# EAGLE schematic main_mux (EAGLE 7.6.0), part 1 of 3
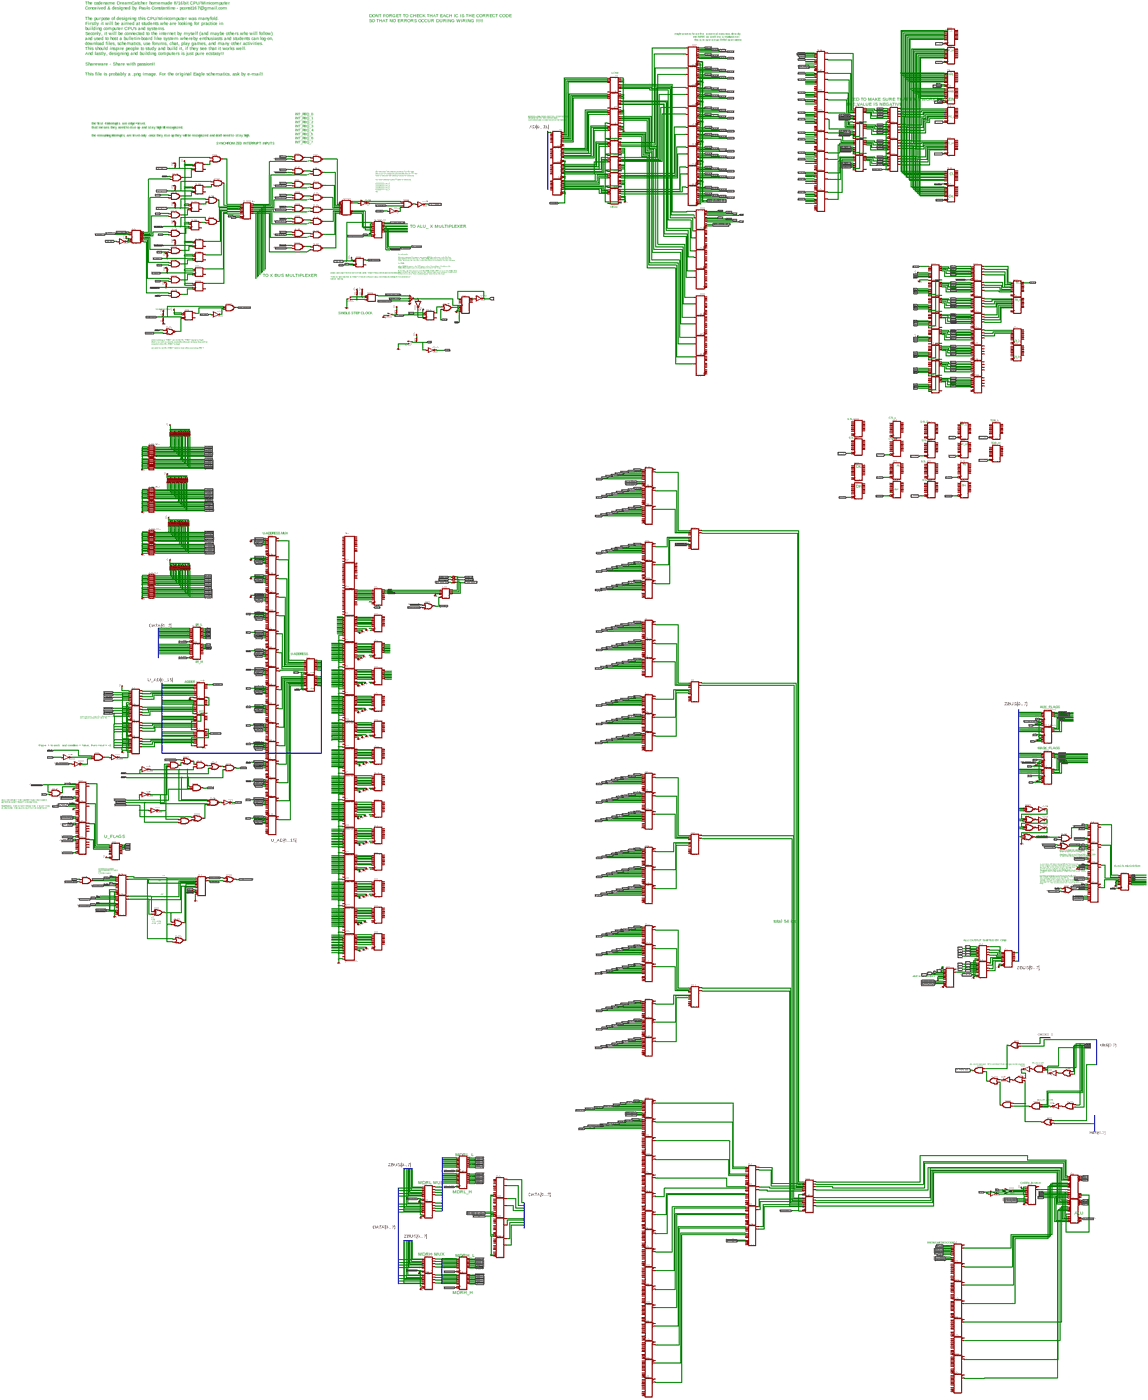
[diagram p0: schematic, sheet 1, overview]
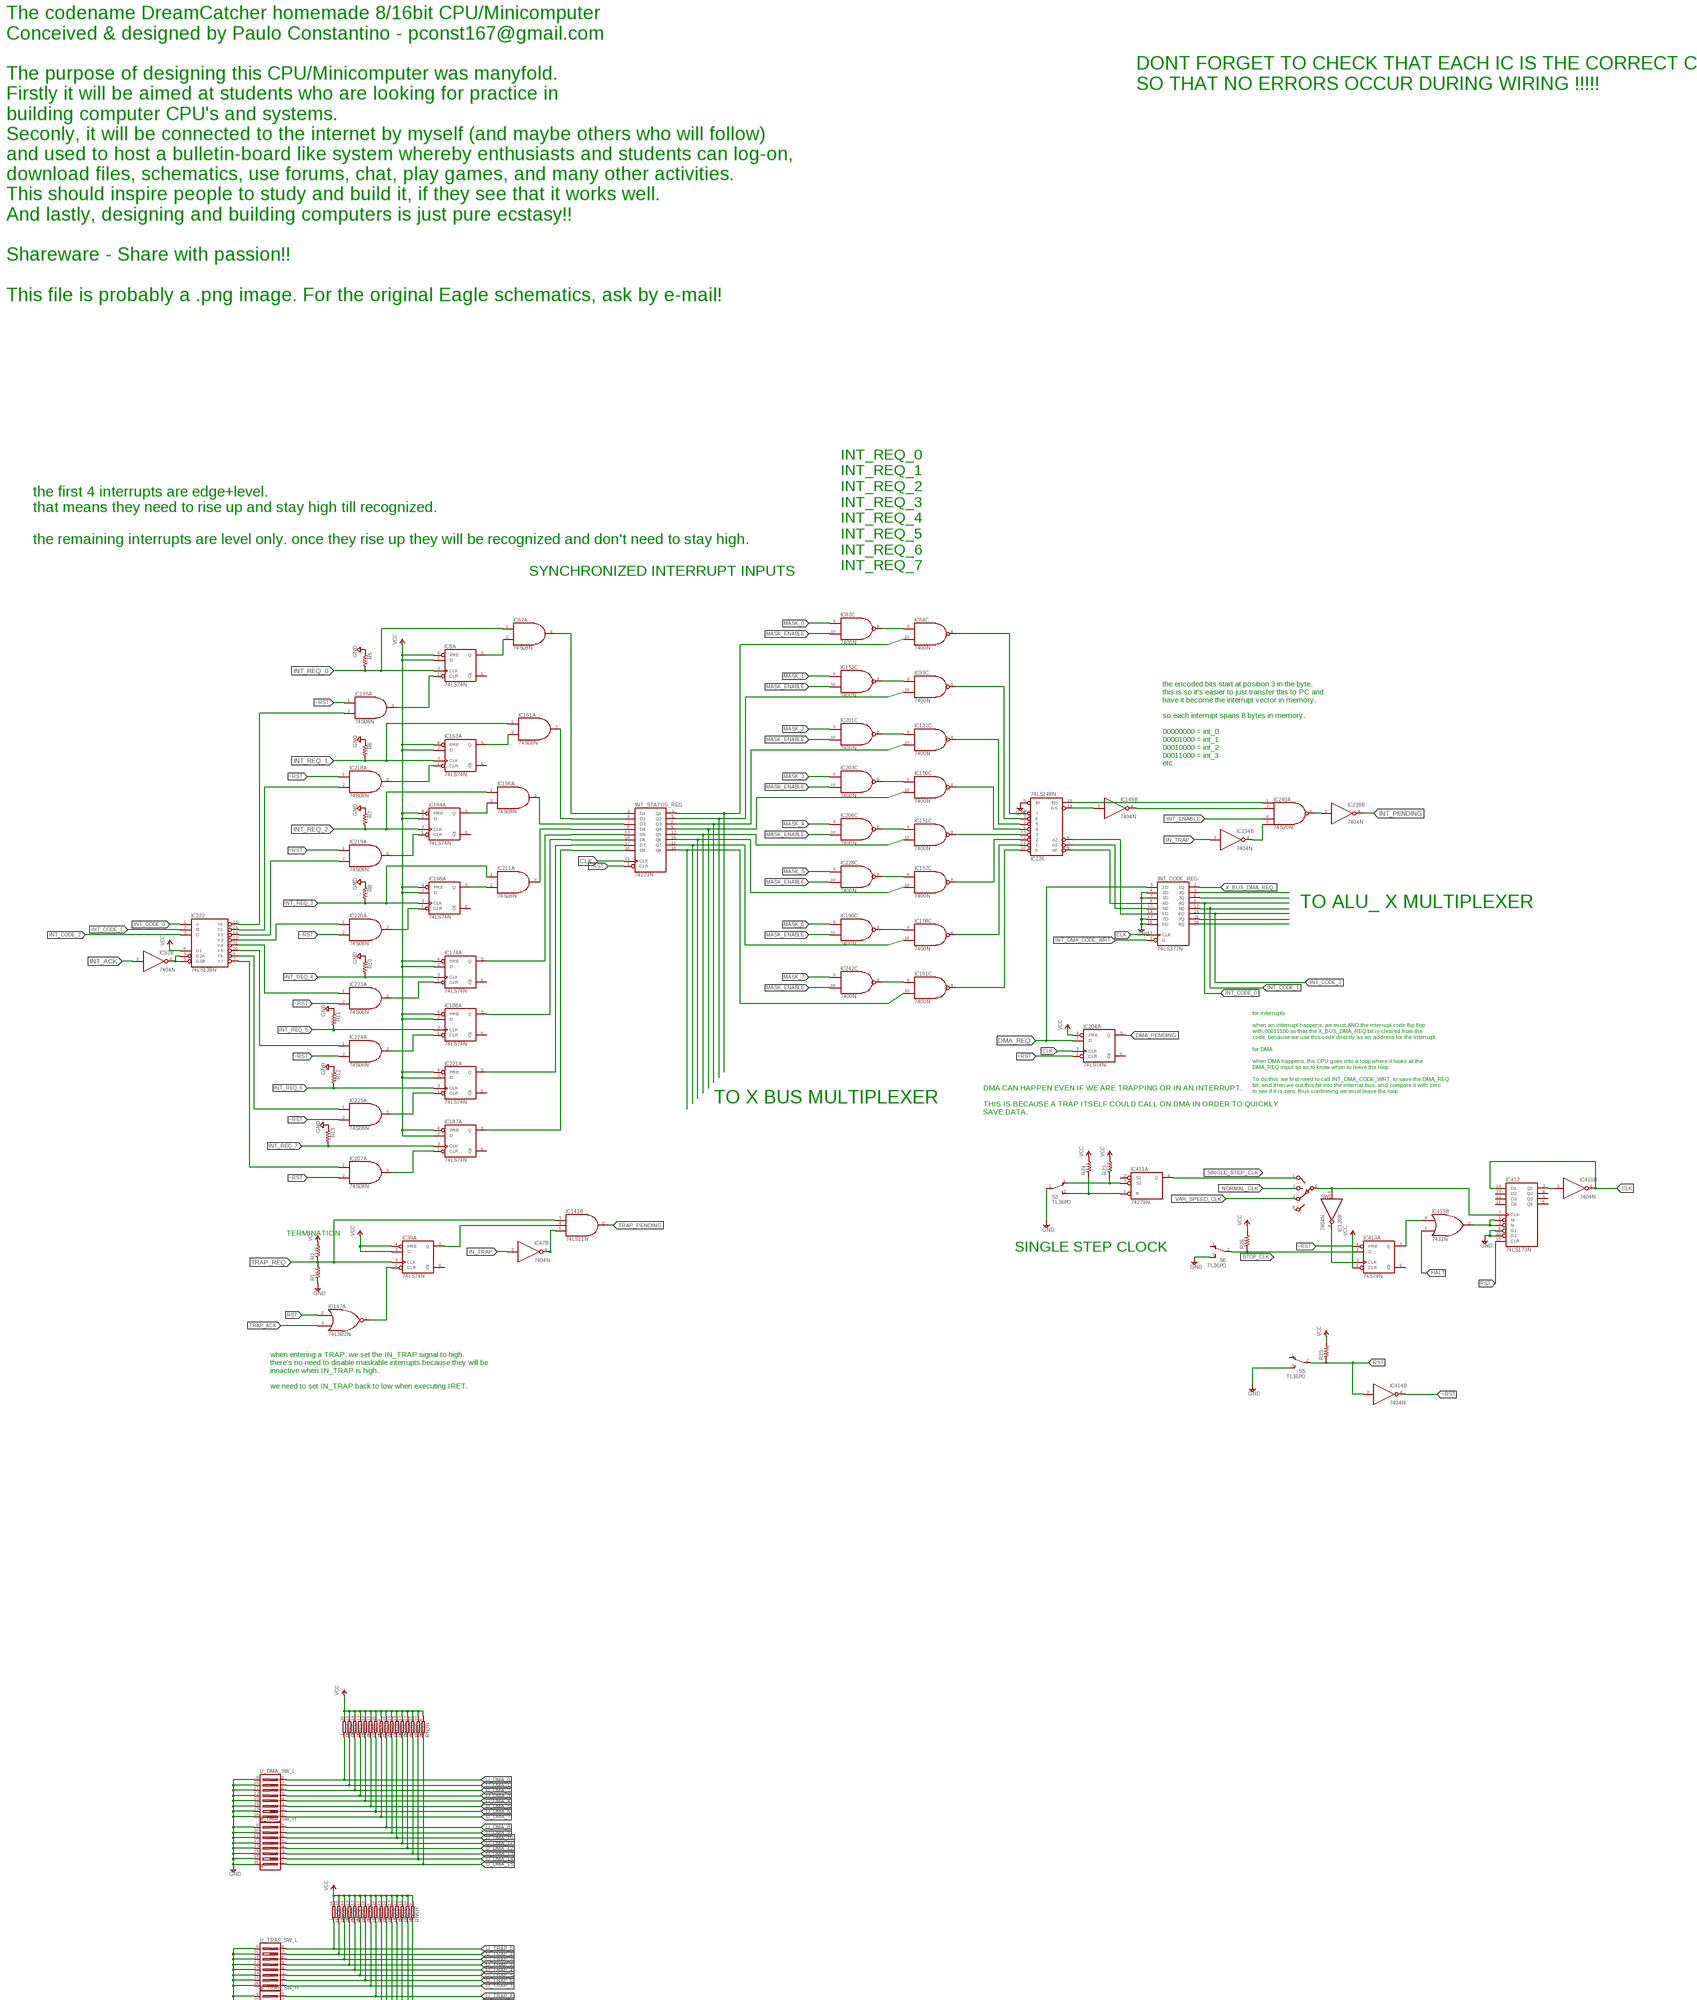
[diagram p1: schematic, sheet 1, part 1 of 6]
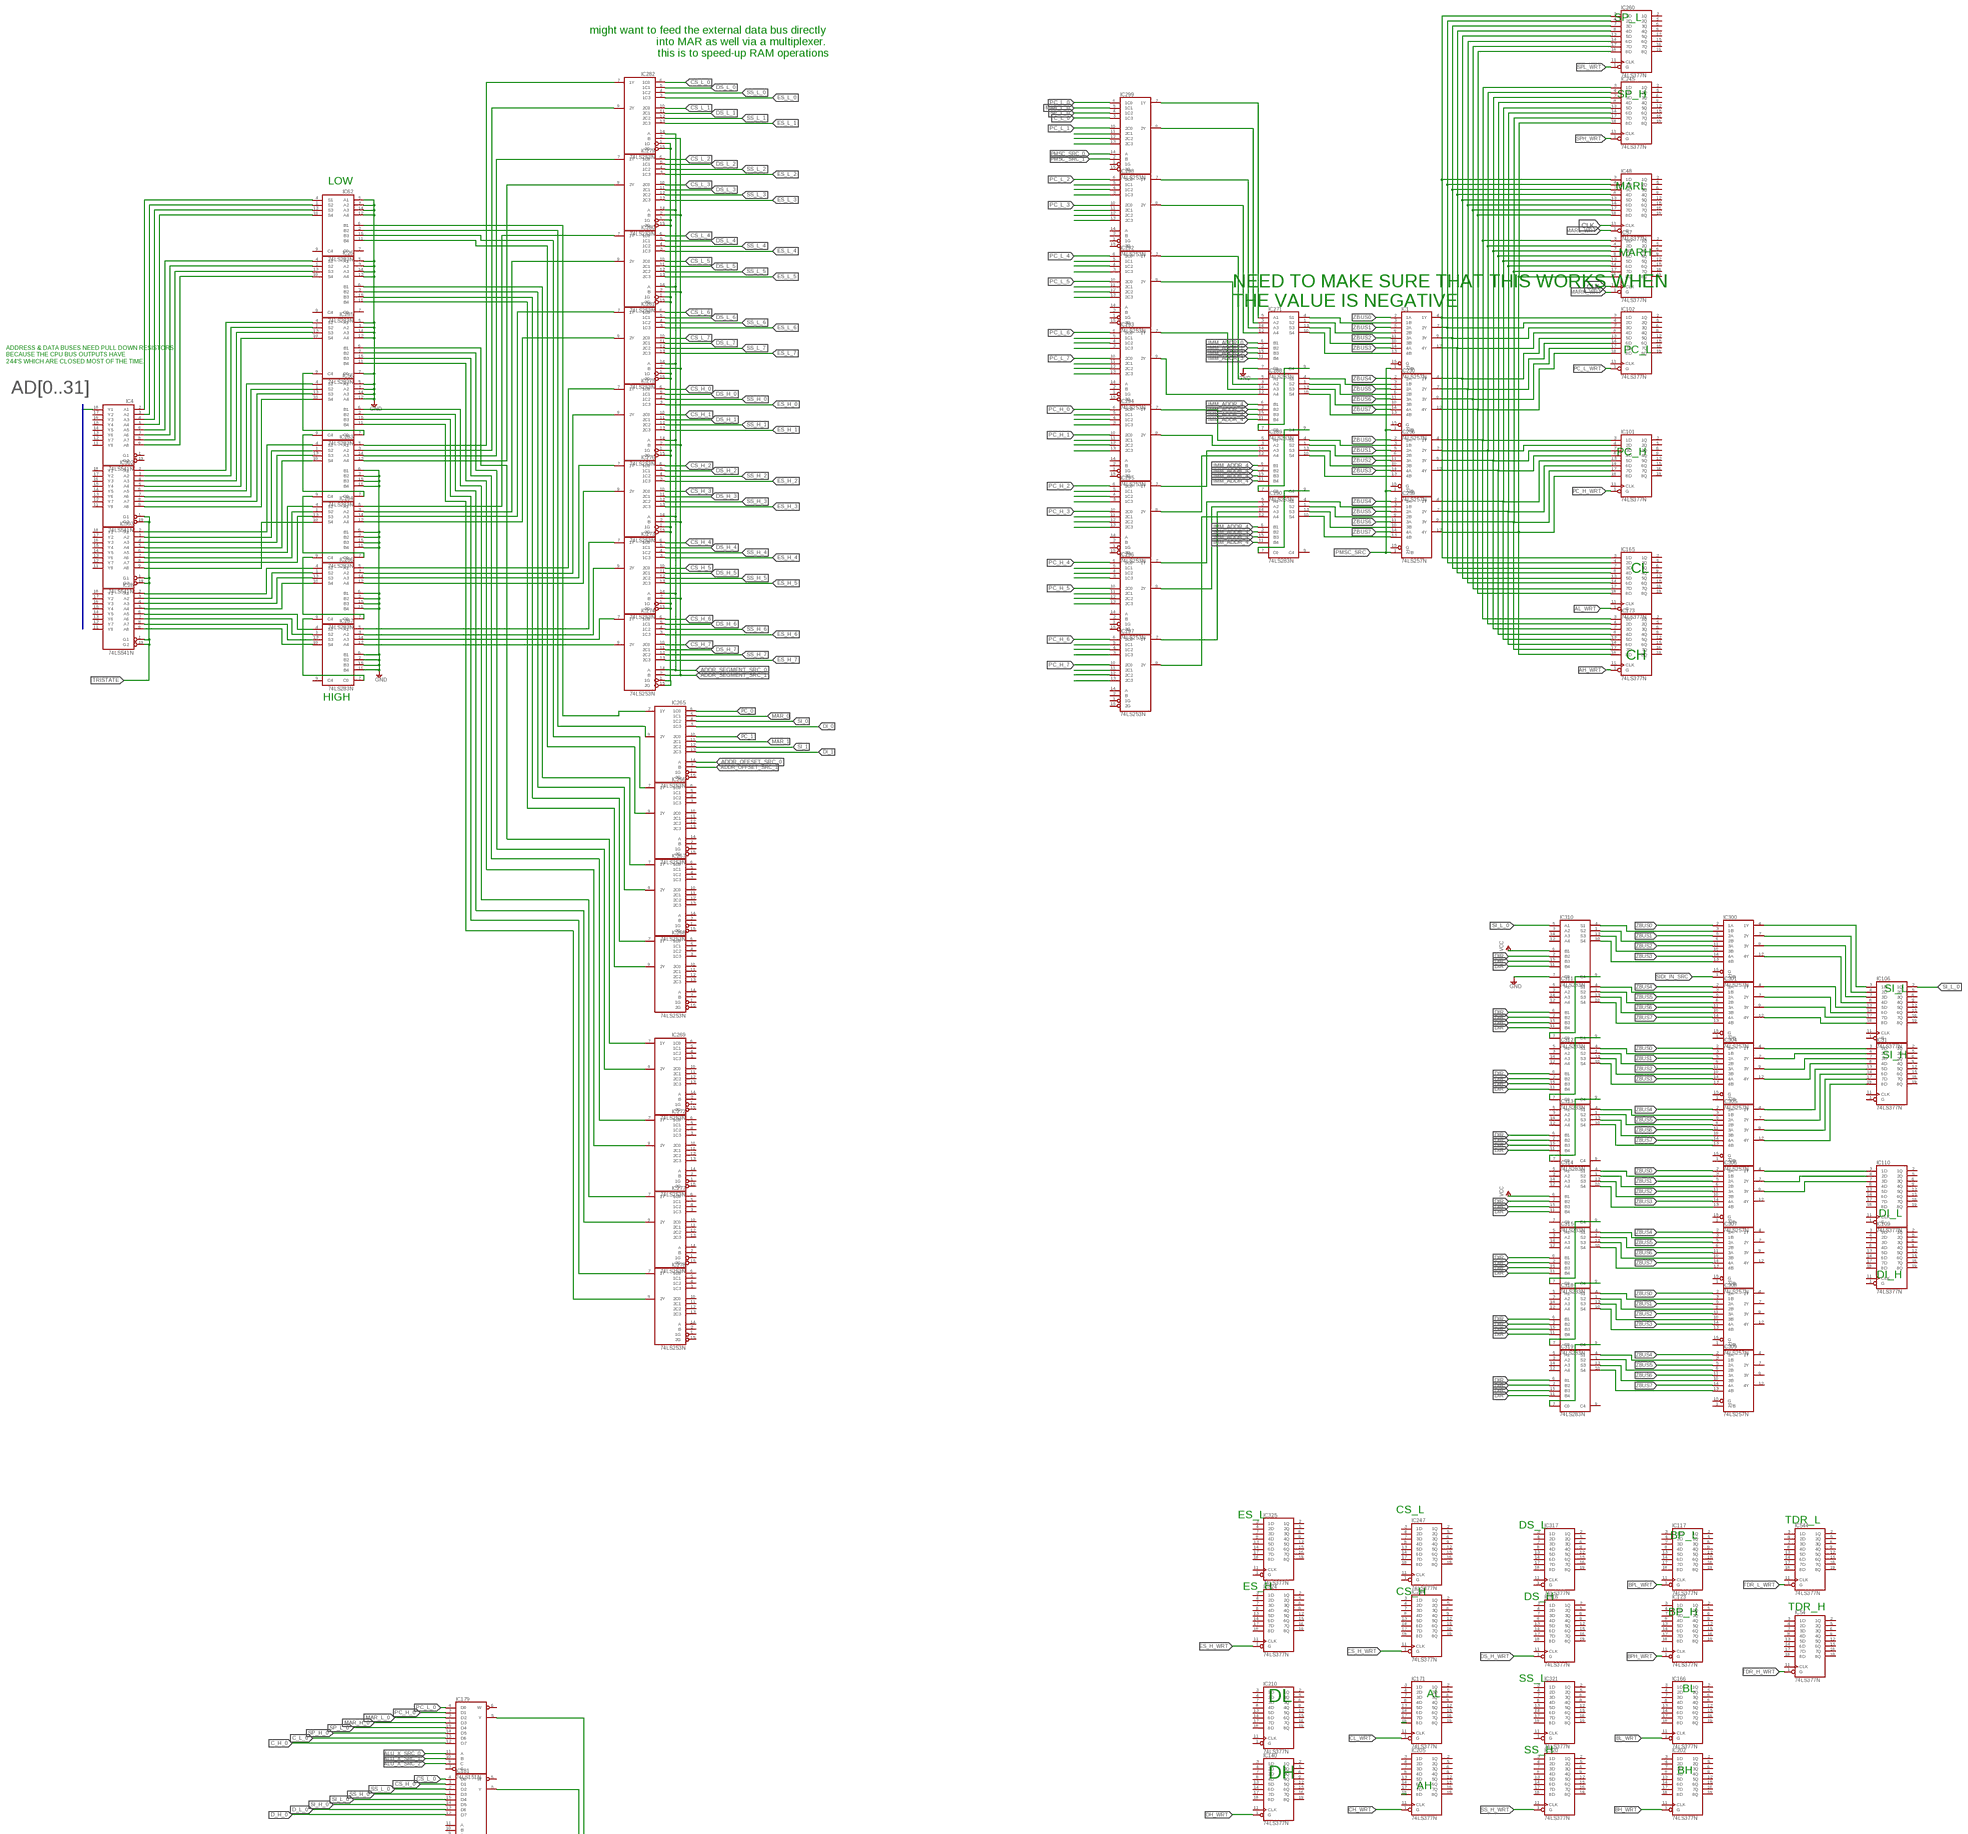
[diagram p2: schematic, sheet 1, part 2 of 6]
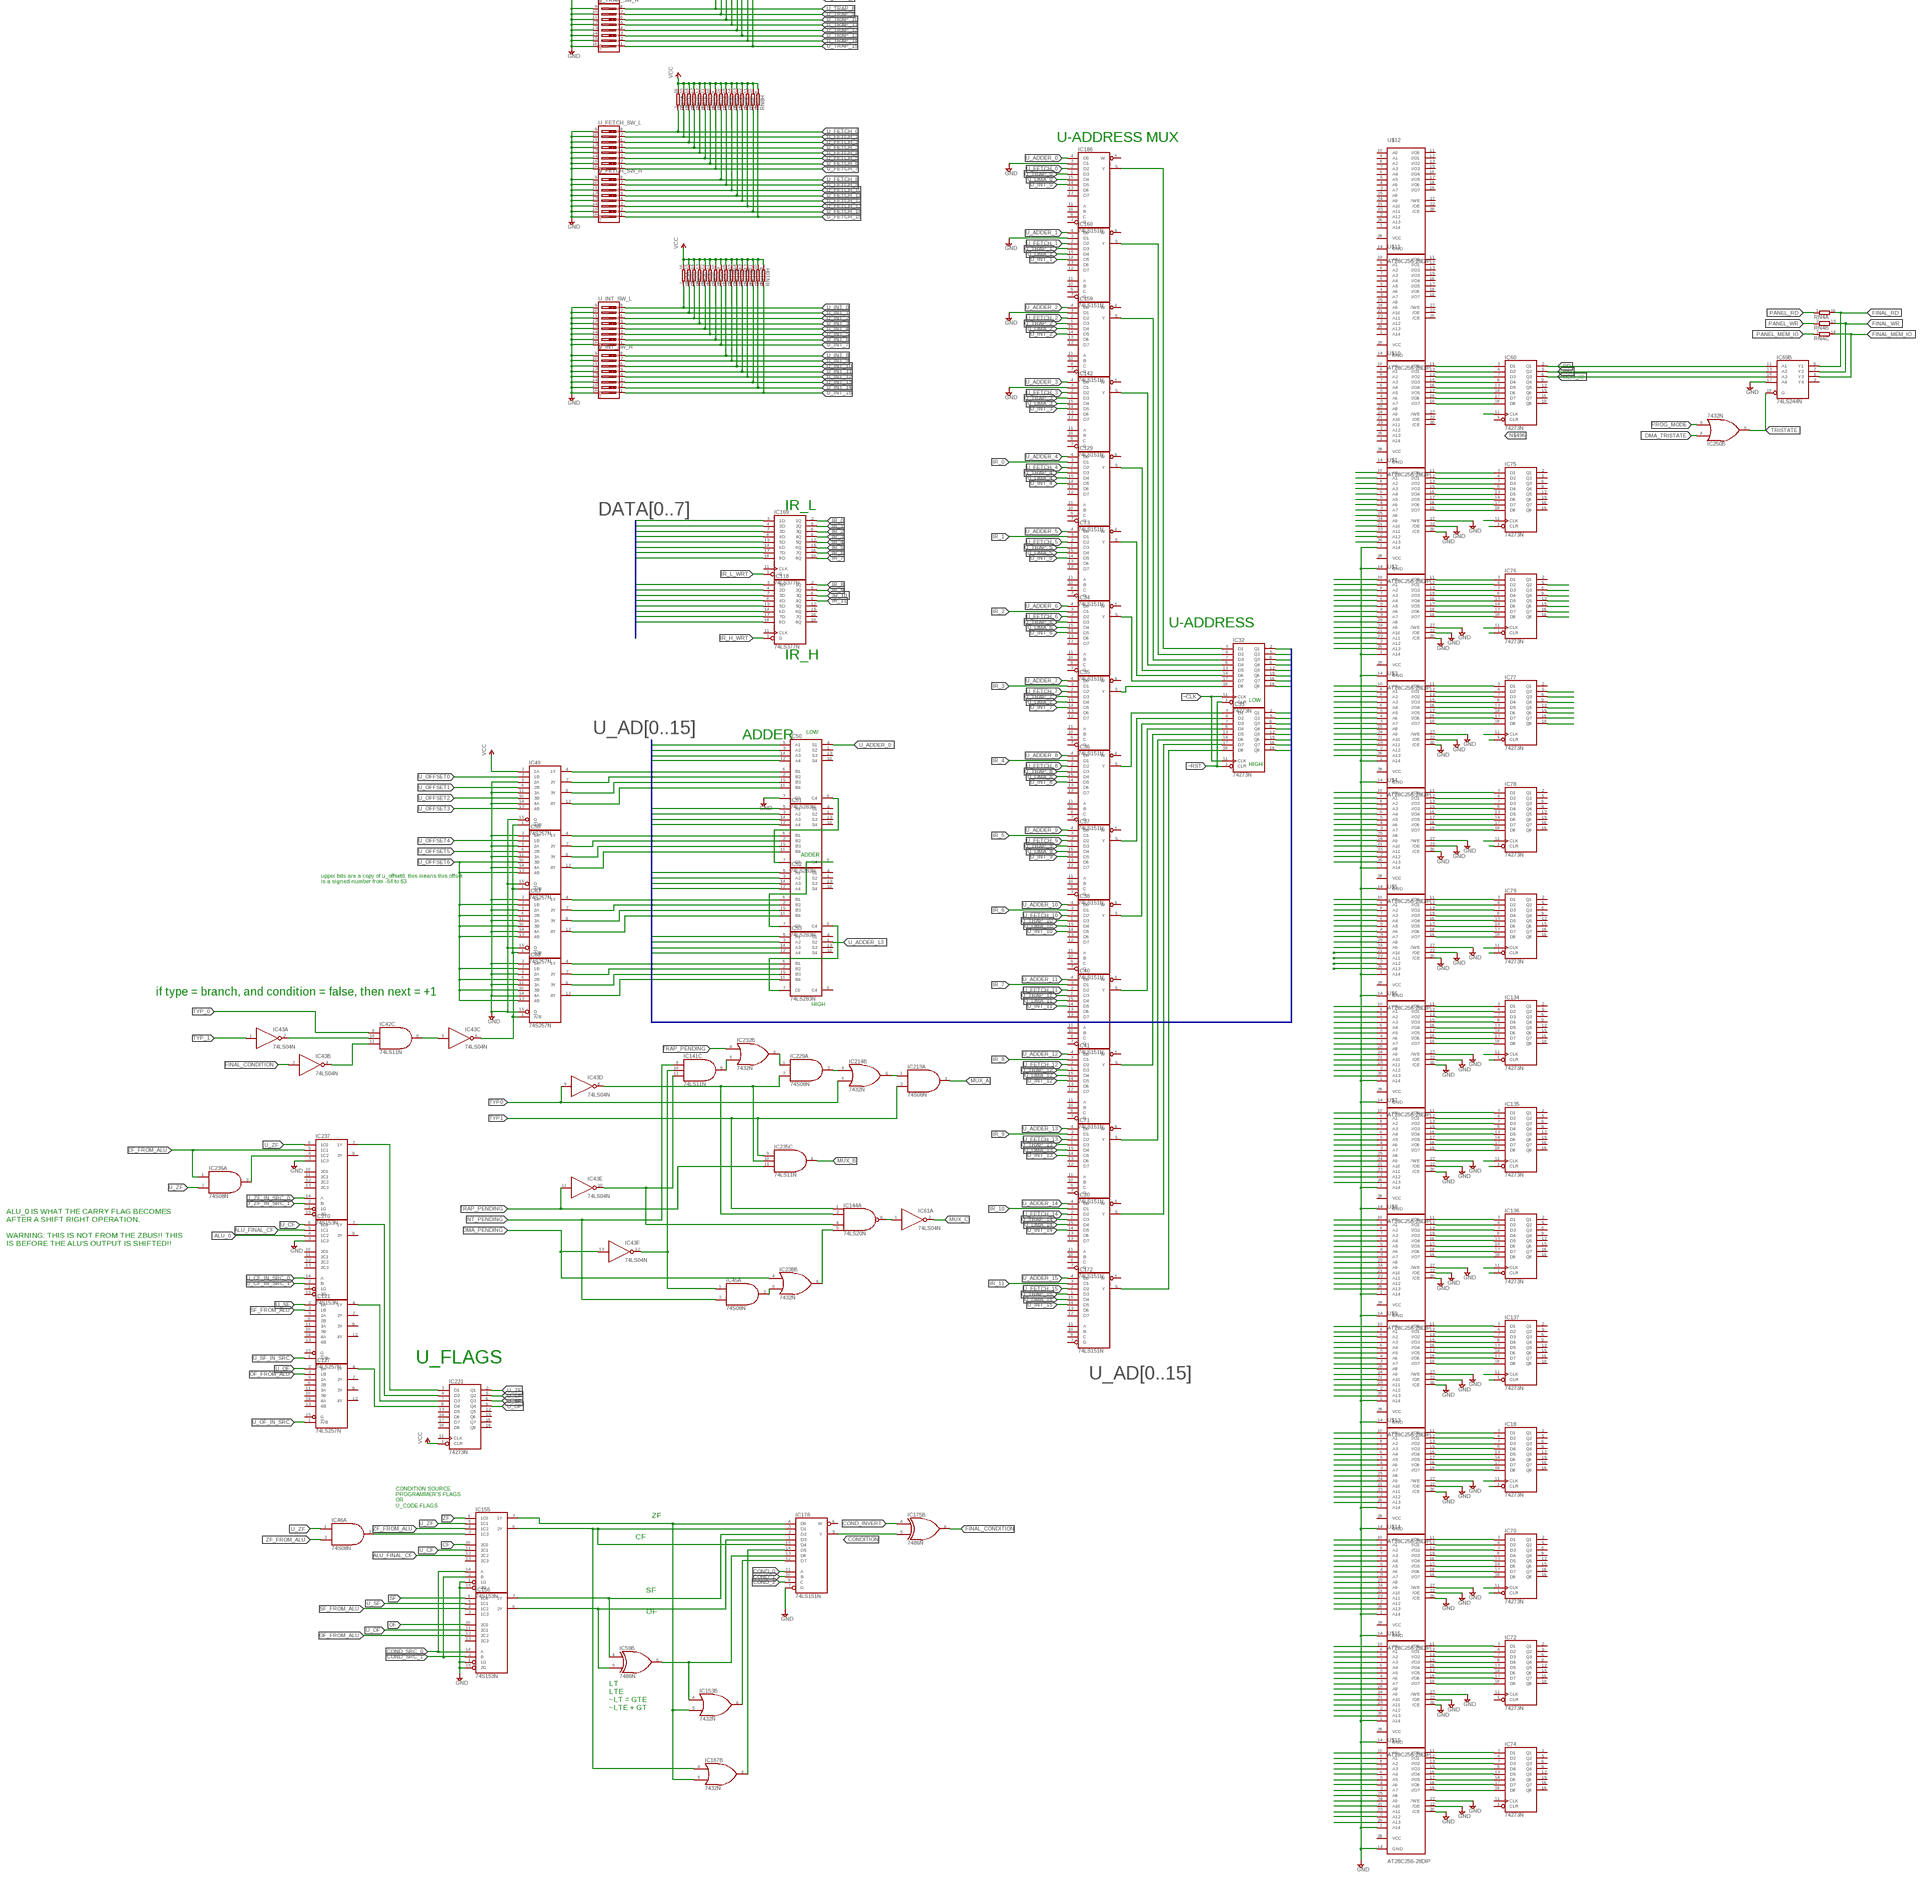
[diagram p3: schematic, sheet 1, part 3 of 6]
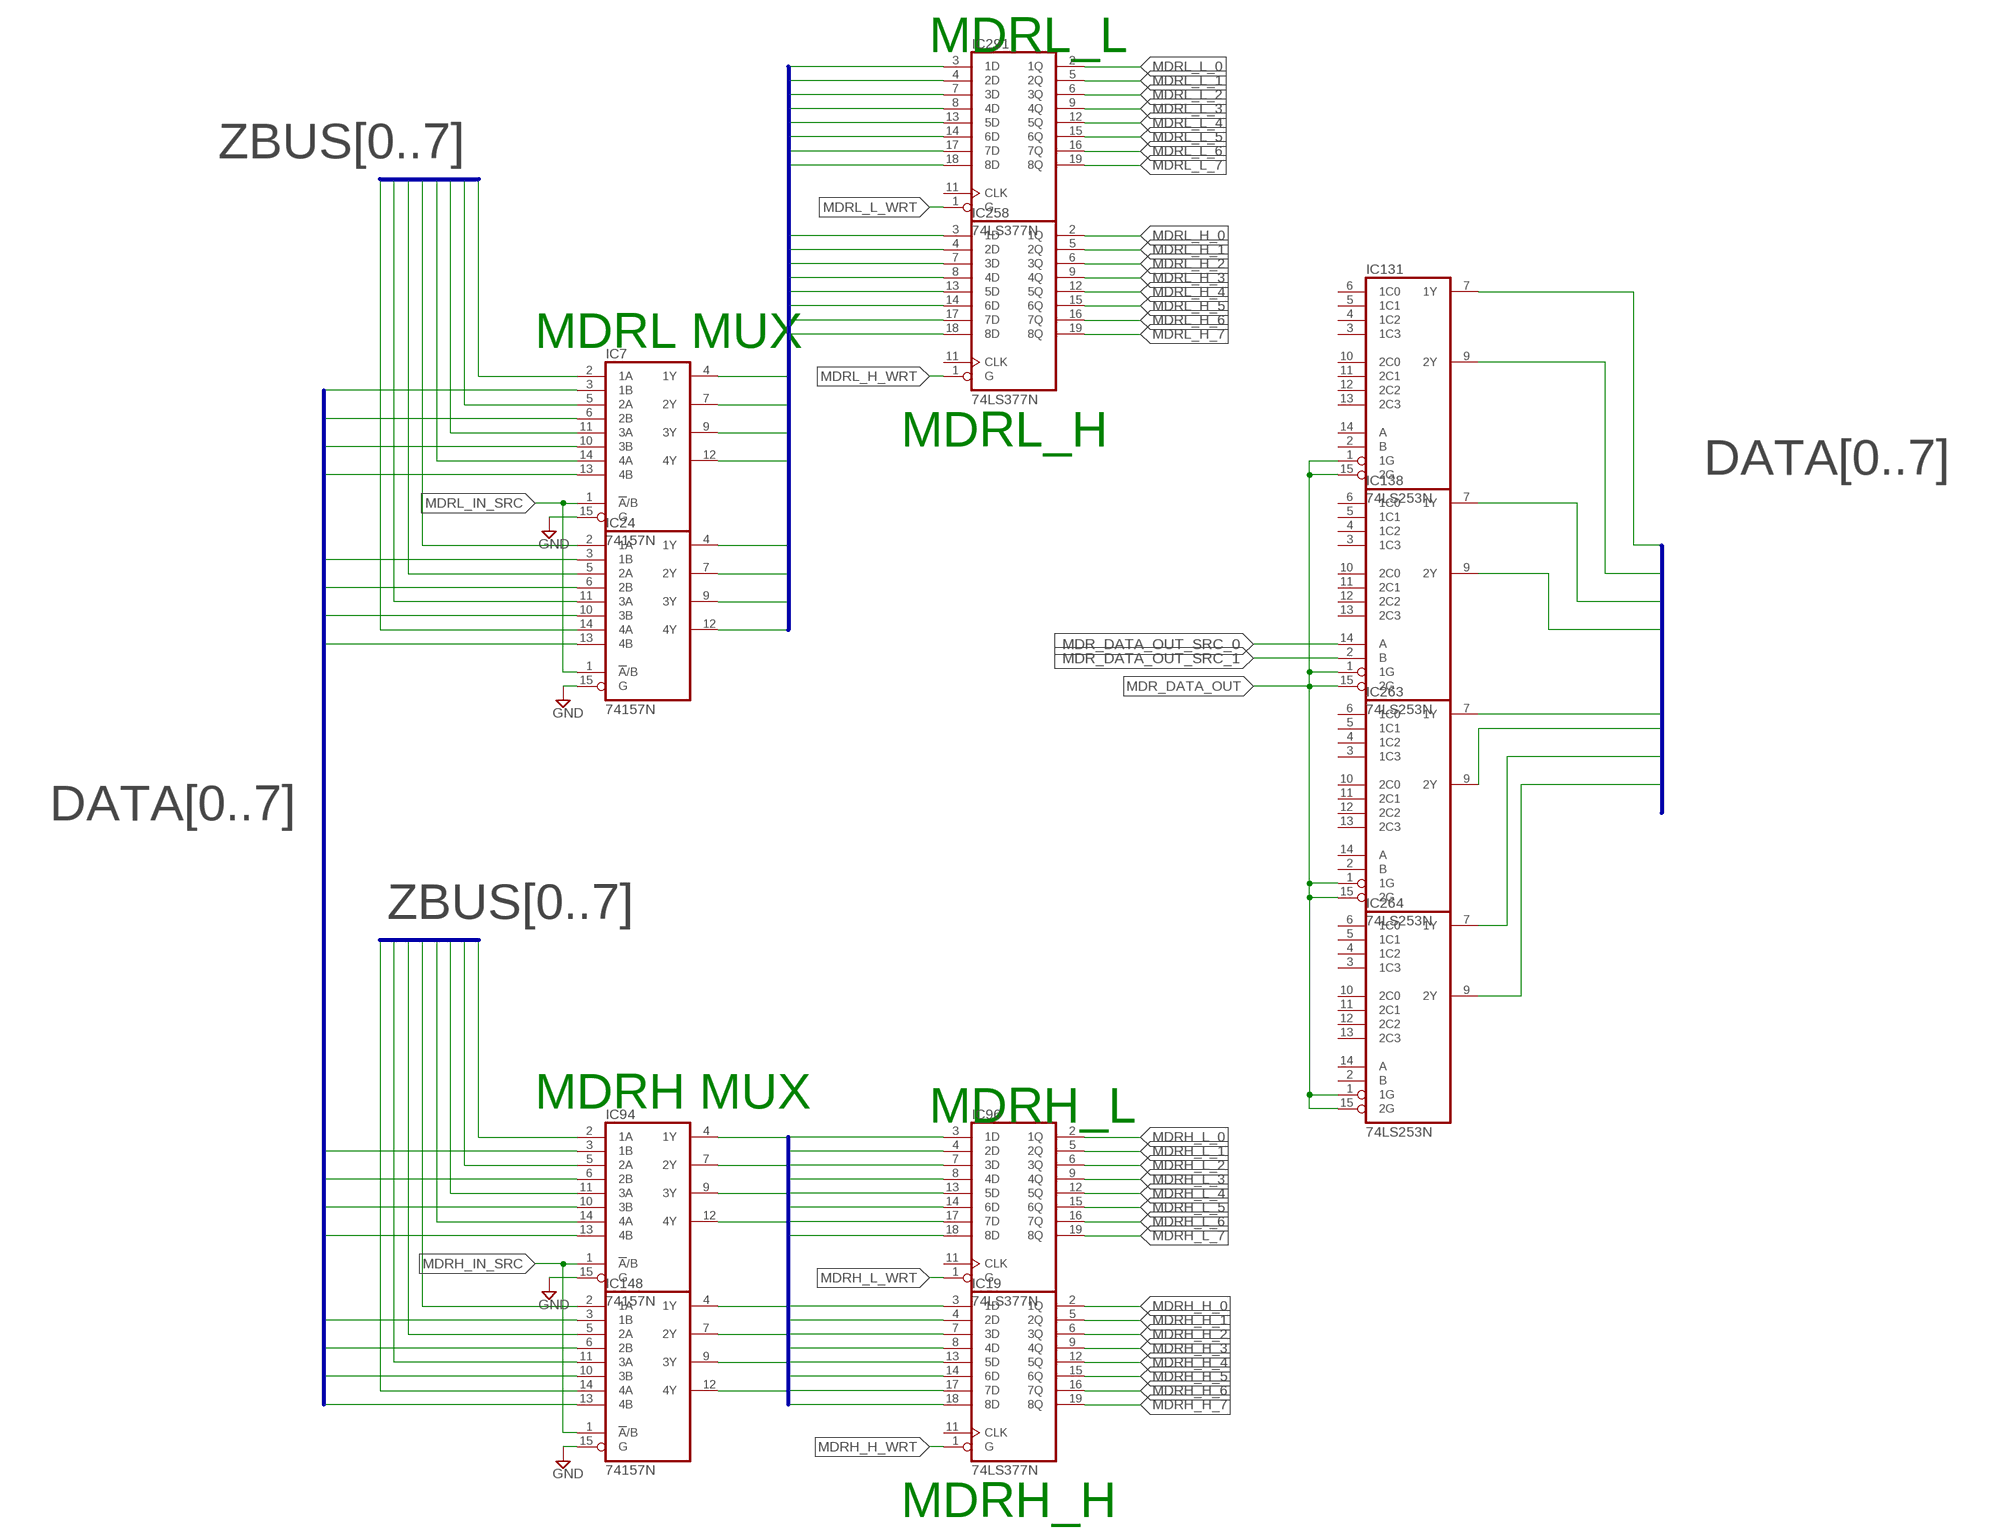
[diagram p4: schematic, sheet 1, part 4 of 6]
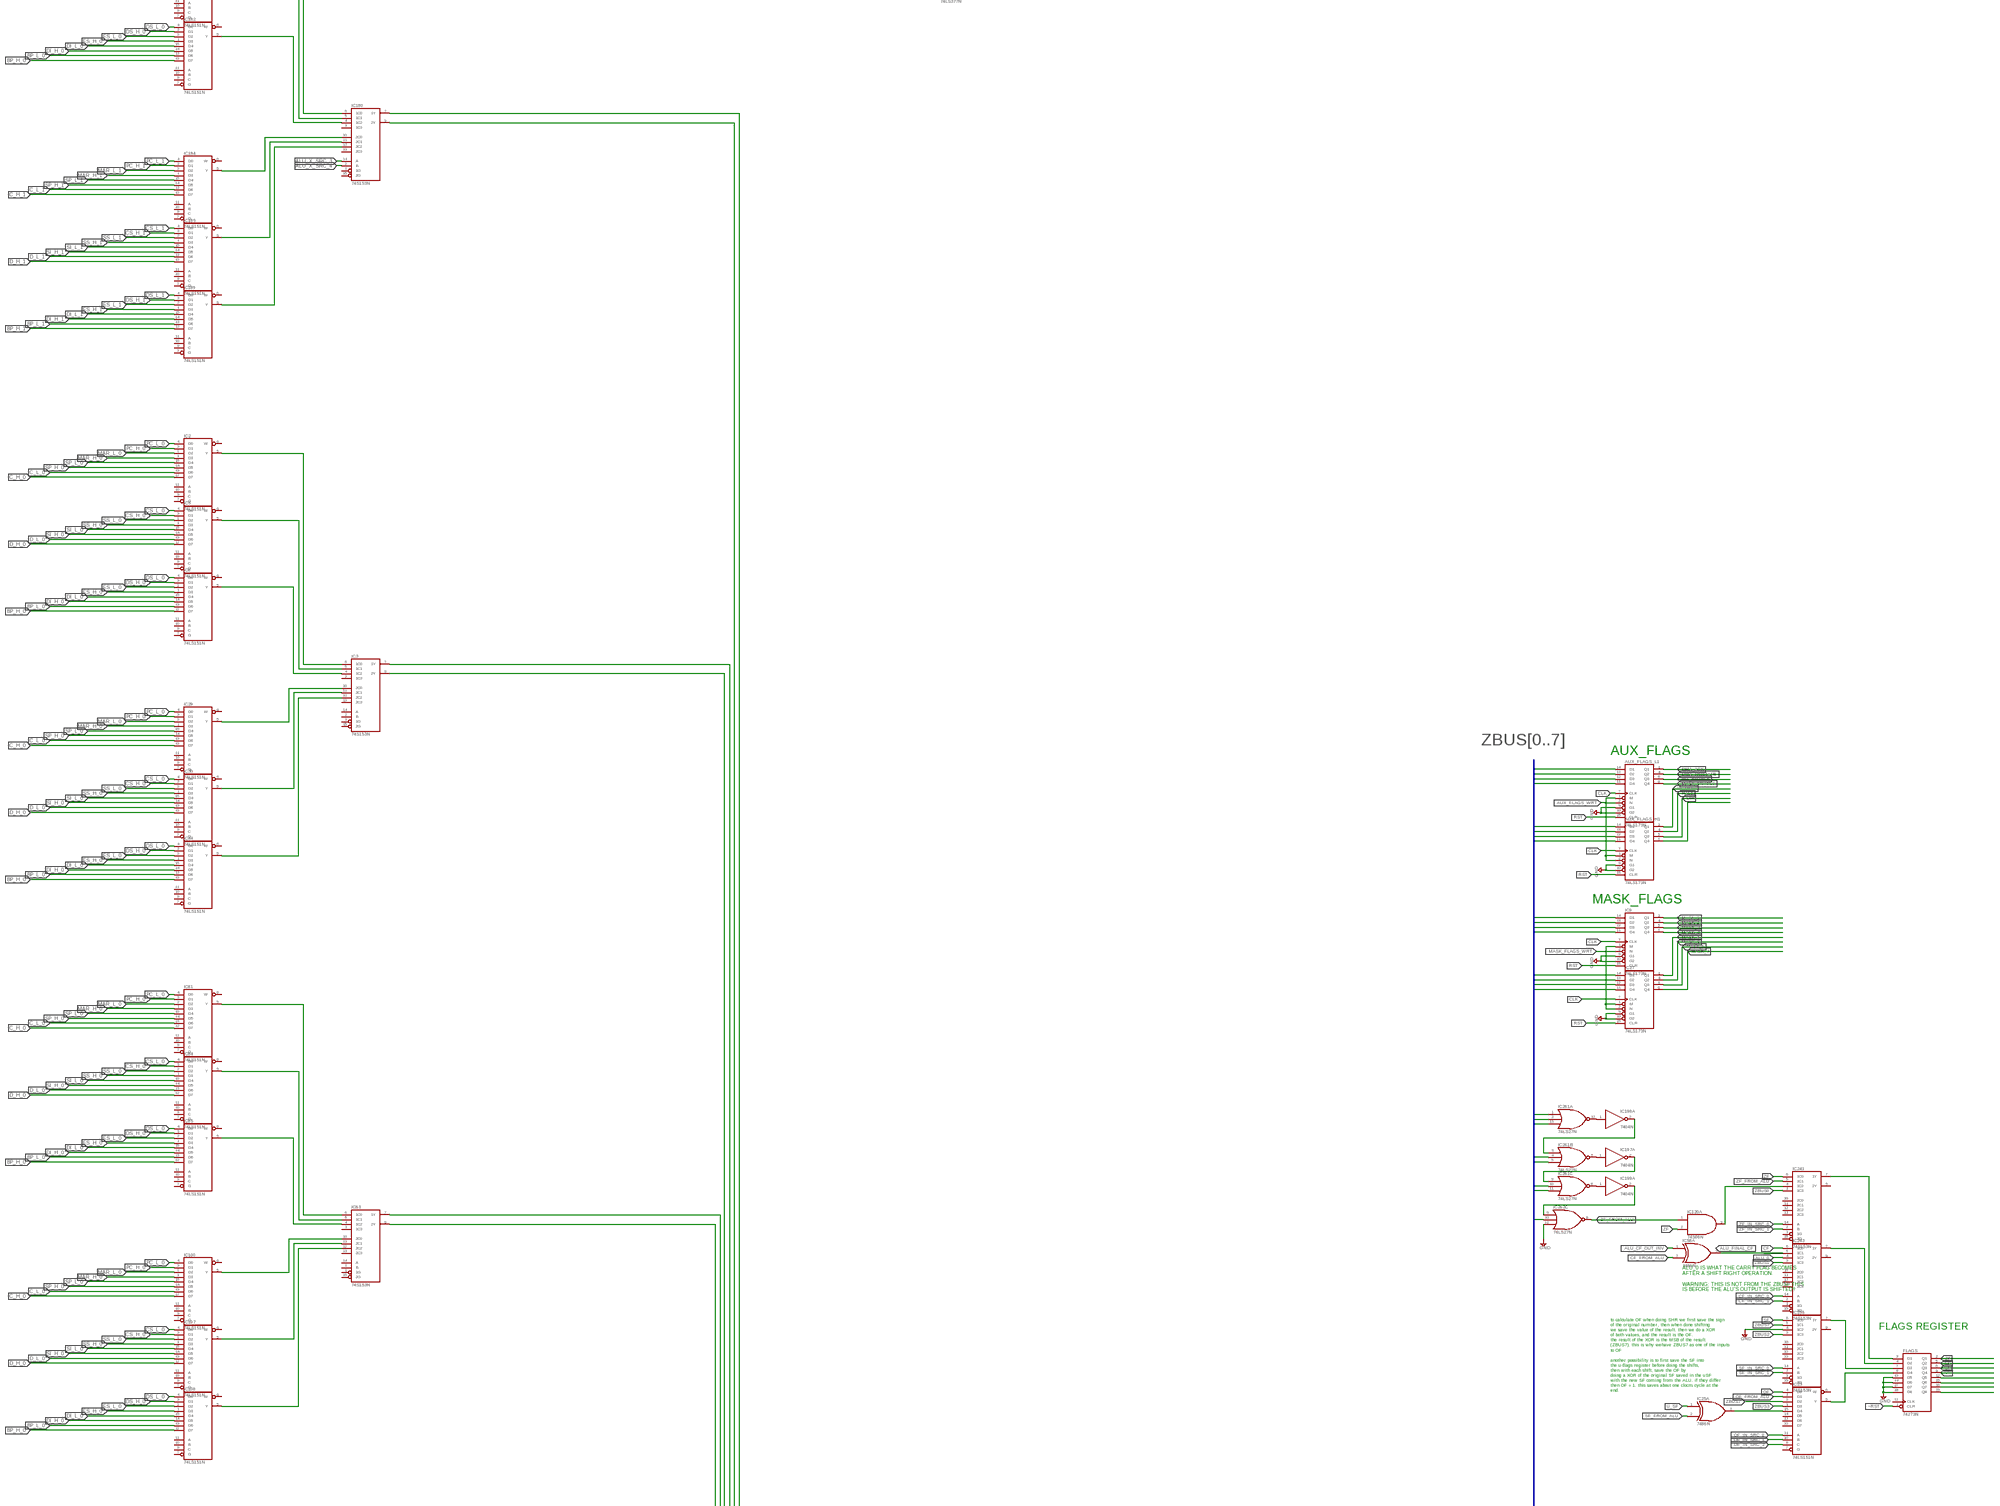
[diagram p5: schematic, sheet 1, part 5 of 6]
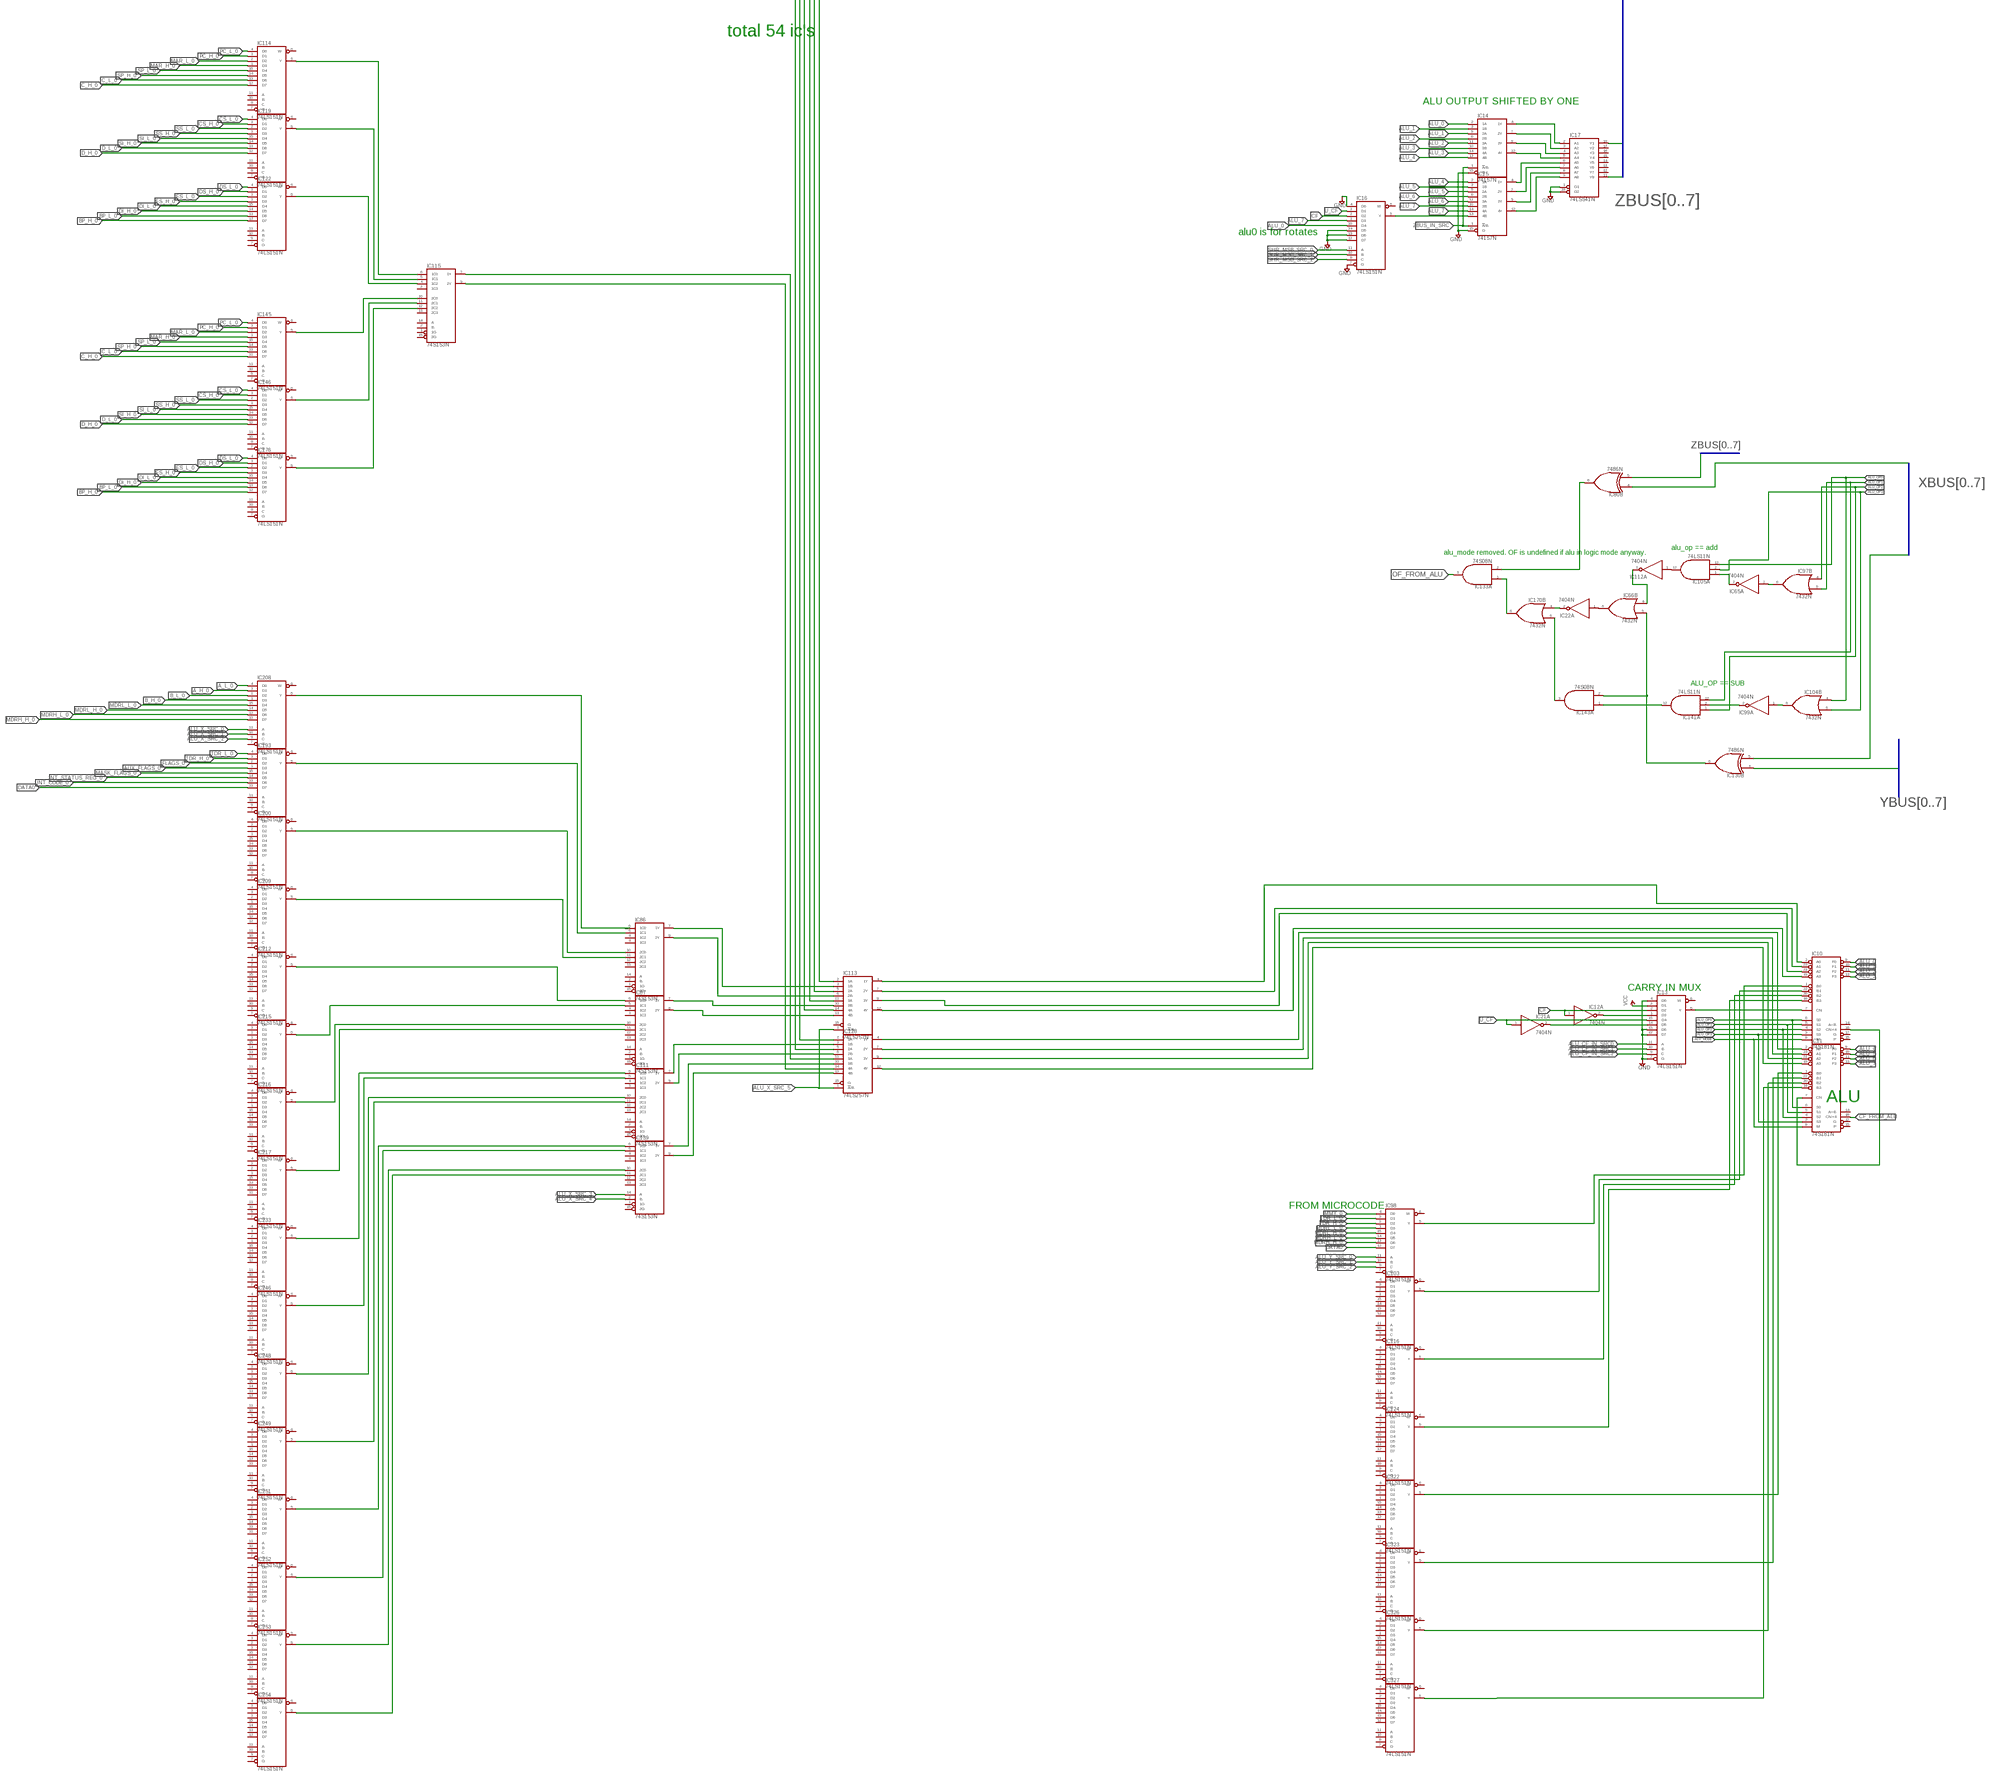
[diagram p6: schematic, sheet 1, part 6 of 6]

## Parts
AUX_FLAGS_H1  74LS173N  [DIL16]
AUX_FLAGS_L1  74LS173N  [DIL16]
FLAGS  74273N  [DIL20]
IC1  74LS257N  [DIL16]
IC2  74LS151N  [DIL16]
IC3  74S153N  [DIL16]
IC4  74LS541N  [DIL20]
IC5  74LS151N  [DIL16]
IC6  74LS151N  [DIL16]
IC7  74157N  [DIL16]
IC8  74LS74N  [DIL14]
IC9  74LS173N  [DIL16]
IC10  74S181N  [DIL24-6]
IC11  74S181N  [DIL24-6]
IC12  7404N  [DIL14]
IC13  74LS151N  [DIL16]
IC14  74157N  [DIL16]
IC15  74157N  [DIL16]
IC16  74LS151N  [DIL16]
IC17  74LS541N  [DIL20]
IC18  74273N  [DIL20]
IC19  74LS377N  [DIL20]
IC20  74LS151N  [DIL16]
IC21  7404N  [DIL14]
IC22  7404N  [DIL14]
IC23  74LS151N  [DIL16]
IC24  74157N  [DIL16]
IC25  7486N  [DIL14]
IC26  74LS283N  [DIL16]
IC27  74LS173N  [DIL16]
IC28  74LS541N  [DIL20]
IC29  74LS151N  [DIL16]
IC30  74LS151N  [DIL16]
IC31  74LS377N  [DIL20]
IC32  74273N  [DIL20]
IC33  74273N  [DIL20]
IC34  74LS151N  [DIL16]
IC35  74LS151N  [DIL16]
IC36  74LS151N  [DIL16]
IC37  74LS151N  [DIL16]
IC38  74LS151N  [DIL16]
IC39  74LS74N  [DIL14]
IC40  74LS151N  [DIL16]
IC41  74LS151N  [DIL16]
IC42  74LS11N  [DIL14]
IC43  74LS04N  [DIL14]
IC44  74LS151N  [DIL16]
IC45  74S08N  [DIL14]
IC46  74S08N  [DIL14]
IC47  7404N  [DIL14]
IC48  74LS377N  [DIL20]
IC49  74S257N  [DIL16]
IC50  74LS283N  [DIL16]
IC51  74LS283N  [DIL16]
IC52  74LS283N  [DIL16]
IC53  74LS283N  [DIL16]
IC54  74LS377N  [DIL20]
IC55  74S257N  [DIL16]
IC56  74LS283N  [DIL16]
IC57  74LS377N  [DIL20]
IC58  7486N  [DIL14]
IC59  7486N  [DIL14]
IC60  74273N  [DIL20]
IC61  74LS04N  [DIL14]
IC62  74LS283N  [DIL16]
IC63  74S257N  [DIL16]
IC64  7400N  [DIL14]
IC65  7404N  [DIL14]
IC66  7432N  [DIL14]
IC67  74S08N  [DIL14]
IC68  74S257N  [DIL16]
IC69  74LS244N  [DIL20]
IC70  74273N  [DIL20]
IC71  74LS151N  [DIL16]
IC72  74273N  [DIL20]
IC73  74LS151N  [DIL16]
IC74  74273N  [DIL20]
IC75  74273N  [DIL20]
IC76  74273N  [DIL20]
IC77  74273N  [DIL20]
IC78  74273N  [DIL20]
IC79  74273N  [DIL20]
IC80  7486N  [DIL14]
IC81  74LS151N  [DIL16]
IC82  7400N  [DIL14]
IC83  74S153N  [DIL16]
IC84  74LS151N  [DIL16]
IC85  74LS151N  [DIL16]
IC86  74S153N  [DIL16]
IC87  74S153N  [DIL16]
IC92  7404N  [DIL14]
IC93  7400N  [DIL14]
IC94  74157N  [DIL16]
IC96  74LS377N  [DIL20]
IC97  7432N  [DIL14]
IC98  74LS151N  [DIL16]
IC99  7404N  [DIL14]
IC100  74LS151N  [DIL16]
IC101  74LS377N  [DIL20]
IC102  74LS377N  [DIL20]
IC103  74LS151N  [DIL16]
IC104  7432N  [DIL14]
IC105  74LS11N  [DIL14]
IC106  74LS377N  [DIL20]
IC107  74LS151N  [DIL16]
IC108  74LS151N  [DIL16]
IC109  74LS377N  [DIL20]
IC110  74LS377N  [DIL20]
IC111  74S153N  [DIL16]
IC112  7404N  [DIL14]
IC113  74LS257N  [DIL16]
IC114  74LS151N  [DIL16]
IC115  74S153N  [DIL16]
IC116  74LS151N  [DIL16]
IC117  74LS377N  [DIL20]
IC118  74LS377N  [DIL20]
IC119  74LS151N  [DIL16]
IC120  74S08N  [DIL14]
IC121  74LS257N  [DIL16]
IC122  74LS151N  [DIL16]
IC123  74LS377N  [DIL20]
IC124  74LS151N  [DIL16]
IC126  7404N  [DIL14]
IC127  74LS257N  [DIL16]
IC128  74LS257N  [DIL16]
IC129  74LS151N  [DIL16]
IC130  7486N  [DIL14]
IC131  74LS253N  [DIL16]
IC132  7400N  [DIL14]
IC133  74S08N  [DIL14]
IC134  74273N  [DIL20]
IC135  74273N  [DIL20]
IC136  74273N  [DIL20]
IC137  74273N  [DIL20]
IC138  74LS253N  [DIL16]
IC139  74S153N  [DIL16]
IC140  74LS377N  [DIL20]
IC141  74LS11N  [DIL14]
IC142  74LS151N  [DIL16]
IC143  74S08N  [DIL14]
IC144  74LS20N  [DIL14]
IC145  74LS151N  [DIL16]
IC146  74LS151N  [DIL16]
IC147  74LS02N  [DIL14]
IC148  74157N  [DIL16]
IC149  7404N  [DIL14]
IC150  7400N  [DIL14]
IC151  7400N  [DIL14]
IC152  7400N  [DIL14]
IC153  7432N  [DIL14]
IC155  74S153N  [DIL16]
IC156  74S153N  [DIL16]
IC157  7400N  [DIL14]
IC158  7400N  [DIL14]
IC159  74LS151N  [DIL16]
IC160  74LS151N  [DIL16]
IC161  74S08N  [DIL14]
IC163  74LS74N  [DIL14]
IC164  74LS74N  [DIL14]
IC165  74LS377N  [DIL20]
IC166  74LS377N  [DIL20]
IC167  7432N  [DIL14]
IC168  74LS74N  [DIL14]
IC169  74LS377N  [DIL20]
IC170  7432N  [DIL14]
IC171  74LS377N  [DIL20]
IC172  74LS151N  [DIL16]
IC173  74LS377N  [DIL20]
IC174  74LS74N  [DIL14]
IC175  7486N  [DIL14]
IC176  74LS151N  [DIL16]
IC178  74LS151N  [DIL16]
IC179  74LS151N  [DIL16]
IC180  74S153N  [DIL16]
IC181  74LS151N  [DIL16]
IC182  74LS151N  [DIL16]
IC184  74LS151N  [DIL16]
IC185  74LS151N  [DIL16]
IC186  74LS151N  [DIL16]
IC187  74LS74N  [DIL14]
IC188  74LS74N  [DIL14]
IC189  74LS151N  [DIL16]
IC190  7400N  [DIL14]
IC191  7400N  [DIL14]
IC193  74LS151N  [DIL16]
IC195  74S08N  [DIL14]
IC196  74S08N  [DIL14]
IC197  7404N  [DIL14]
IC198  7404N  [DIL14]
IC199  7404N  [DIL14]
IC200  74LS151N  [DIL16]
IC201  7400N  [DIL14]
IC202  74LS377N  [DIL20]
IC203  7400N  [DIL14]
IC204  74LS74N  [DIL14]
IC205  74LS377N  [DIL20]
IC206  7400N  [DIL14]
IC207  74S08N  [DIL14]
IC208  74LS151N  [DIL16]
IC209  74LS151N  [DIL16]
IC210  74LS377N  [DIL20]
IC211  74S08N  [DIL14]
IC212  74LS151N  [DIL16]
IC213  74S08N  [DIL14]
IC214  7432N  [DIL14]
IC215  74LS151N  [DIL16]
IC216  74LS151N  [DIL16]
IC217  74LS151N  [DIL16]
IC218  74S08N  [DIL14]
IC219  74S08N  [DIL14]
IC220  74S08N  [DIL14]
IC221  74LS74N  [DIL14]
IC222  74LS138N  [DIL16]
IC223  74S08N  [DIL14]
IC224  74S08N  [DIL14]
IC225  74S08N  [DIL14]
IC226  74LS148N  [DIL16]
IC228  7400N  [DIL14]
IC229  74S08N  [DIL14]
IC230  74LS257N  [DIL16]
IC231  74273N  [DIL20]
IC232  7432N  [DIL14]
IC233  74LS151N  [DIL16]
IC234  7404N  [DIL14]
IC235  74LS11N  [DIL14]
IC236  74S08N  [DIL14]
IC237  74S153N  [DIL16]
IC238  7432N  [DIL14]
IC239  7404N  [DIL14]
IC240  74S20N  [DIL14]
IC241  74S153N  [DIL16]
IC242  7400N  [DIL14]
IC243  74S153N  [DIL16]
IC244  74LS377N  [DIL20]
IC245  74LS377N  [DIL20]
IC246  74LS151N  [DIL16]
IC247  74LS377N  [DIL20]
IC248  74LS151N  [DIL16]
IC249  74LS151N  [DIL16]
IC250  7432N  [DIL14]
IC251  74LS151N  [DIL16]
IC252  74LS151N  [DIL16]
IC253  74LS151N  [DIL16]
IC254  74LS151N  [DIL16]
IC255  74S153N  [DIL16]
IC256  74LS257N  [DIL16]
IC258  74LS377N  [DIL20]
IC259  74LS257N  [DIL16]
IC260  74LS377N  [DIL20]
IC261  74LS27N  [DIL14]
IC262  74LS27N  [DIL14]
IC263  74LS253N  [DIL16]
IC264  74LS253N  [DIL16]
IC265  74LS253N  [DIL16]
IC266  74LS253N  [DIL16]
IC267  74LS253N  [DIL16]
IC268  74LS253N  [DIL16]
IC269  74LS253N  [DIL16]
IC270  74S153N  [DIL16]
IC271  74LS283N  [DIL16]
IC272  74LS253N  [DIL16]
IC273  74LS253N  [DIL16]
IC274  74LS253N  [DIL16]
IC275  74LS253N  [DIL16]
IC276  74LS253N  [DIL16]
IC277  74LS253N  [DIL16]
IC278  74LS253N  [DIL16]
IC279  74LS253N  [DIL16]
IC280  74LS253N  [DIL16]
IC281  74LS253N  [DIL16]
IC282  74LS253N  [DIL16]
IC283  74LS283N  [DIL16]
IC284  74LS283N  [DIL16]
IC285  74LS283N  [DIL16]
IC286  74LS283N  [DIL16]
IC287  74LS283N  [DIL16]
IC288  74LS283N  [DIL16]
IC289  74LS283N  [DIL16]
IC290  74LS283N  [DIL16]
IC291  74LS377N  [DIL20]
IC292  74LS253N  [DIL16]
IC293  74LS253N  [DIL16]
IC294  74LS253N  [DIL16]
IC295  74LS253N  [DIL16]
IC296  74LS253N  [DIL16]
IC297  74LS253N  [DIL16]
IC298  74LS253N  [DIL16]
IC299  74LS253N  [DIL16]
IC300  74LS257N  [DIL16]
IC301  74LS257N  [DIL16]
IC302  74LS541N  [DIL20]
IC303  74LS541N  [DIL20]
IC304  74LS257N  [DIL16]
IC305  74LS257N  [DIL16]
IC306  74LS257N  [DIL16]
IC307  74LS257N  [DIL16]
IC308  74LS257N  [DIL16]
IC309  74LS257N  [DIL16]
IC310  74LS283N  [DIL16]
IC311  74LS283N  [DIL16]
IC312  74LS283N  [DIL16]
IC313  74LS283N  [DIL16]
IC314  74LS283N  [DIL16]
IC315  74LS283N  [DIL16]
IC316  74LS377N  [DIL20]
IC317  74LS377N  [DIL20]
IC318  74LS283N  [DIL16]
IC319  74LS283N  [DIL16]
IC320  74LS377N  [DIL20]
IC321  74LS377N  [DIL20]
IC322  74LS151N  [DIL16]
IC323  74LS151N  [DIL16]
IC324  74LS377N  [DIL20]
IC325  74LS377N  [DIL20]
IC326  74LS151N  [DIL16]
IC327  74LS151N  [DIL16]
IC410  7404N  [DIL14]
IC411  74279N  [DIL16]
IC412  74LS173N  [DIL16]
IC413  74S74N  [DIL14]
IC414  7404N  [DIL14]
IC415  7432N  [DIL14]
IC544  74LS377N  [DIL20]
INT_CODE_REG  74LS377N  [DIL20]
INT_STATUS_REG  74273N  [DIL20]
R1  R-US_0204/7  [0204/7]
R2  R-US_0204/7  [0204/7]
R5  R-US_0204/7  [0204/7]
R6  R-US_0204/7  [0204/7]
R7  R-US_0204/7  [0204/7]
R8  R-US_0204/7  [0204/7]
R10  R-US_0204/7  [0204/7]
R11  R-US_0204/7  [0204/7]
R12  R-US_0204/7  [0204/7]
R13  R-US_0204/7  [0204/7]
R23  R-US_0204/2V  [0204V]
R24  R-US_0204/2V  [0204V]
R25  R-US_0204/2V  [0204V]
R26  R-US_0204/2V  [0204V]
RN2  8R-N  [DIL16]
RN3  8R-N  [DIL16]
RN4  8R-N  [DIL16]
RN5  8R-N  [DIL16]
RN6  8R-N  [DIL16]
RN7  8R-N  [DIL16]
RN8  8R-N  [DIL16]
RN9  8R-N  [DIL16]
RN10  8R-N  [DIL16]
S3  TL36PO  [TL3XPO]
S5  TL36PO  [TL3XPO]
S6  TL36PO  [TL3XPO]
SW1  SW-C10  [SW-C10]
U$1  AT28C256-28DIP  [DIL28-6]
U$2  AT28C256-28DIP  [DIL28-6]
U$3  AT28C256-28DIP  [DIL28-6]
U$4  AT28C256-28DIP  [DIL28-6]
U$5  AT28C256-28DIP  [DIL28-6]
U$6  AT28C256-28DIP  [DIL28-6]
U$7  AT28C256-28DIP  [DIL28-6]
U$8  AT28C256-28DIP  [DIL28-6]
U$9  AT28C256-28DIP  [DIL28-6]
U$10  AT28C256-28DIP  [DIL28-6]
U$11  AT28C256-28DIP  [DIL28-6]
U$12  AT28C256-28DIP  [DIL28-6]
U$13  AT28C256-28DIP  [DIL28-6]
U$14  AT28C256-28DIP  [DIL28-6]
U$15  AT28C256-28DIP  [DIL28-6]
U$16  AT28C256-28DIP  [DIL28-6]
U_DMA_SW_H  SW_DIP-8  [EDG-08]
U_DMA_SW_L  SW_DIP-8  [EDG-08]
U_FETCH_SW_H  SW_DIP-8  [EDG-08]
U_FETCH_SW_L  SW_DIP-8  [EDG-08]
U_INT_SW_H  SW_DIP-8  [EDG-08]
U_INT_SW_L  SW_DIP-8  [EDG-08]
U_TRAP_SW_H  SW_DIP-8  [EDG-08]
U_TRAP_SW_L  SW_DIP-8  [EDG-08]

## Nets
1: IC153.5(B:I1) IC167.5(B:I1) IC178.4(D0)
2: IC167.4(B:I0) IC178.3(D1) IC178.15(D4)
3: IC59.4(B:I0) IC178.2(D2)
4: IC59.5(B:I1) IC178.1(D3)
654654: FLAGS.16(Q7)
5434534: FLAGS.15(Q6)
A_H_0: IC208.3(D1)
A_L_0: IC208.4(D0)
AD0: IC4.18(Y1)
ADDR_OFFSET_SRC_0: IC265.14(A)
ADDR_OFFSET_SRC_1: IC265.2(B)
ADDR_SEGMENT_SRC_0: IC273.14(A) IC274.14(A) IC275.14(A) IC276.14(A) IC279.14(A) IC280.14(A) IC281.14(A) IC282.14(A)
ADDR_SEGMENT_SRC_1: IC273.2(B) IC274.2(B) IC275.2(B) IC276.2(B) IC279.2(B) IC280.2(B) IC281.2(B) IC282.2(B)
AH_WRT: IC173.1(G)
AL_WRT: IC165.1(G)
ALU_0: IC10.9(F0) IC14.2(1A) IC16.15(D4) IC243.4(1C2) IC270.4(1C2)
ALU_1: IC10.10(F1) IC14.3(1B) IC14.5(2A)
ALU_2: IC10.11(F2) IC14.6(2B) IC14.11(3A)
ALU_3: IC10.13(F3) IC14.10(3B) IC14.14(4A)
ALU_4: IC11.9(F0) IC14.13(4B) IC15.2(1A)
ALU_5: IC11.10(F1) IC15.3(1B) IC15.5(2A)
ALU_6: IC11.11(F2) IC15.6(2B) IC15.11(3A)
ALU_7: IC11.13(F3) IC15.10(3B) IC15.14(4A) IC16.1(D3)
ALU_CF_IN_SRC0: IC13.11(A)
ALU_CF_IN_SRC1: IC13.10(B)
ALU_CF_IN_SRC2: IC13.9(C)
ALU_CF_OUT_INV: IC58.1(A:I0)
ALU_FINAL_CF: IC58.3(A:O) IC155.12(2C2) IC243.5(1C1) IC270.5(1C1)
ALU_MODE: IC10.8(M) IC11.8(M)
ALU_OP0: IC10.6(S0) IC11.6(S0) IC104.4(B:I0) IC105.13(A:I2)
ALU_OP1: IC10.5(S1) IC11.5(S1) IC97.5(B:I1) IC141.13(A:I2)
ALU_OP2: IC10.4(S2) IC11.4(S2) IC97.4(B:I0) IC141.1(A:I0)
ALU_OP3: IC10.3(S3) IC11.3(S3) IC104.5(B:I1) IC105.2(A:I1)
ALU_X_SRC_0: IC179.11(A) IC208.11(A)
ALU_X_SRC_1: IC179.10(B) IC208.10(B)
ALU_X_SRC_2: IC179.9(C) IC208.9(C)
ALU_X_SRC_3: IC180.14(A)
ALU_X_SRC_4: IC139.2(B) IC180.2(B)
ALU_X_SRC_5: IC113.1(!A!/B) IC128.1(!A!/B)
ALU_Y_SRC_0: IC98.11(A)
ALU_Y_SRC_1: IC98.10(B)
ALU_Y_SRC_2: IC98.9(C)
AUX_FLAGS_0: IC193.1(D3)
AUX_FLAGS_WRT: AUX_FLAGS_H1.1(M) AUX_FLAGS_H1.2(N) AUX_FLAGS_L1.1(M) AUX_FLAGS_L1.2(N)
B_H_0: IC208.1(D3)
B_L_0: IC208.2(D2)
BH_WRT: IC202.1(G)
BL_WRT: IC166.1(G)
BP_H_0: IC6.12(D7) IC44.12(D7) IC85.12(D7) IC108.12(D7) IC122.12(D7) IC176.12(D7) IC182.12(D7)
BP_H_1: IC189.12(D7)
BP_L_0: IC6.13(D6) IC44.13(D6) IC85.13(D6) IC108.13(D6) IC122.13(D6) IC176.13(D6) IC182.13(D6)
BP_L_1: IC189.13(D6)
BPH_WRT: IC123.1(G)
BPL_WRT: IC117.1(G)
C_H_0: IC2.12(D7) IC29.12(D7) IC81.12(D7) IC100.12(D7) IC114.12(D7) IC145.12(D7) IC179.12(D7)
C_H_1: IC184.12(D7)
C_L_0: IC2.13(D6) IC29.13(D6) IC81.13(D6) IC100.13(D6) IC114.13(D6) IC145.13(D6) IC179.13(D6) IC299.3(1C3)
C_L_1: IC184.13(D6)
CF: FLAGS.5(Q2) IC12.1(A:I) IC13.2(D2) IC16.2(D2) IC155.10(2C0) IC243.6(1C0)
CF_FROM_ALU: IC11.16(CN+4) IC58.2(A:I1)
CF_IN_SRC_0: IC243.14(A)
CF_IN_SRC_1: IC243.2(B)
CH_WRT: IC205.1(G)
CL_WRT: IC171.1(G)
CLK: AUX_FLAGS_H1.7(CLK) AUX_FLAGS_L1.7(CLK) IC9.7(CLK) IC27.7(CLK) IC48.11(CLK) IC57.11(CLK) IC137.11(CLK) IC204.3(A:CLK) IC410.4(B:O) IC412.14(D1) INT_CODE_REG.11(CLK) INT_STATUS_REG.11(CLK)
COND_0: IC178.11(A)
COND_1: IC178.10(B)
COND_2: IC178.9(C)
COND_INVERT: IC175.4(B:I0)
COND_SRC_0: IC155.14(A) IC156.14(A)
COND_SRC_1: IC155.2(B) IC156.2(B)
CONDITION: IC175.5(B:I1) IC178.5(Y)
CS_H_0: IC5.3(D1) IC30.3(D1) IC84.3(D1) IC107.3(D1) IC119.3(D1) IC146.3(D1) IC181.3(D1) IC275.6(1C0)
CS_H_1: IC185.3(D1) IC275.10(2C0)
CS_H_2: IC276.6(1C0)
CS_H_3: IC276.10(2C0)
CS_H_4: IC273.6(1C0)
CS_H_5: IC273.10(2C0)
CS_H_6: IC274.6(1C0)
CS_H_7: IC274.10(2C0)
CS_H_WRT: IC244.1(G)
CS_L_0: IC5.4(D0) IC30.4(D0) IC84.4(D0) IC107.4(D0) IC119.4(D0) IC146.4(D0) IC181.4(D0) IC282.6(1C0)
CS_L_1: IC185.4(D0) IC282.10(2C0)
CS_L_2: IC279.6(1C0)
CS_L_3: IC279.10(2C0)
CS_L_4: IC280.6(1C0)
CS_L_5: IC280.10(2C0)
CS_L_6: IC281.6(1C0)
CS_L_7: IC281.10(2C0)
D_H_0: IC5.12(D7) IC30.12(D7) IC84.12(D7) IC107.12(D7) IC119.12(D7) IC146.12(D7) IC181.12(D7)
D_H_1: IC185.12(D7)
D_L_0: IC5.13(D6) IC30.13(D6) IC84.13(D6) IC107.13(D6) IC119.13(D6) IC146.13(D6) IC181.13(D6)
D_L_1: IC185.13(D6)
DATA0: IC98.12(D7) IC118.3(1D) IC131.7(1Y) IC169.3(1D) IC193.12(D7)
DATA1: IC118.4(2D) IC131.9(2Y) IC169.4(2D)
DATA2: IC118.7(3D) IC138.7(1Y) IC169.7(3D)
DATA3: IC118.8(4D) IC138.9(2Y) IC169.8(4D)
DATA4: IC118.13(5D) IC169.13(5D) IC263.7(1Y)
DATA5: IC118.14(6D) IC169.14(6D) IC263.9(2Y)
DATA6: IC118.17(7D) IC169.17(7D) IC264.7(1Y)
DATA7: IC118.18(8D) IC169.18(8D) IC264.9(2Y)
DH_WRT: IC140.1(G)
DI_0: IC265.3(1C3)
DI_1: IC265.13(2C3)
DI_H_0: IC6.14(D5) IC44.14(D5) IC85.14(D5) IC108.14(D5) IC122.14(D5) IC176.14(D5) IC182.14(D5)
DI_H_1: IC189.14(D5)
DI_L_0: IC6.15(D4) IC44.15(D4) IC85.15(D4) IC108.15(D4) IC122.15(D4) IC176.15(D4) IC182.15(D4)
DI_L_1: IC189.15(D4)
DIR: AUX_FLAGS_H1.5(Q3) IC314.2(B2) IC314.11(B4) IC314.15(B3) IC315.2(B2) IC315.6(B1) IC315.11(B4) IC315.15(B3) IC318.2(B2) IC318.6(B1) IC318.11(B4) IC318.15(B3) IC319.2(B2) IC319.6(B1) IC319.11(B4) IC319.15(B3)
DMA_ACK: AUX_FLAGS_L1.3(Q1)
DMA_PENDING: IC43.13(F:I) IC204.5(A:Q) IC238.4(B:I0)
DMA_REQ: IC204.2(A:D) INT_CODE_REG.3(1D)
DMA_TRISTATE: AUX_FLAGS_L1.4(Q2) IC250.4(B:I0)
DS_H_0: IC6.3(D1) IC44.3(D1) IC85.3(D1) IC108.3(D1) IC122.3(D1) IC176.3(D1) IC182.3(D1) IC275.5(1C1)
DS_H_1: IC189.3(D1) IC275.11(2C1)
DS_H_2: IC276.5(1C1)
DS_H_3: IC276.11(2C1)
DS_H_4: IC273.5(1C1)
DS_H_5: IC273.11(2C1)
DS_H_6: IC274.5(1C1)
DS_H_7: IC274.11(2C1)
DS_H_WRT: IC316.1(G)
DS_L_0: IC6.4(D0) IC44.4(D0) IC85.4(D0) IC108.4(D0) IC122.4(D0) IC176.4(D0) IC182.4(D0) IC282.5(1C1)
DS_L_1: IC189.4(D0) IC282.11(2C1)
DS_L_2: IC279.5(1C1)
DS_L_3: IC279.11(2C1)
DS_L_4: IC280.5(1C1)
DS_L_5: IC280.11(2C1)
DS_L_6: IC281.5(1C1)
DS_L_7: IC281.11(2C1)
ES_H_0: IC6.1(D3) IC44.1(D3) IC85.1(D3) IC108.1(D3) IC122.1(D3) IC176.1(D3) IC182.1(D3) IC275.3(1C3)
ES_H_1: IC189.1(D3) IC275.13(2C3)
ES_H_2: IC276.3(1C3)
ES_H_3: IC276.13(2C3)
ES_H_4: IC273.3(1C3)
ES_H_5: IC273.13(2C3)
ES_H_6: IC274.3(1C3)
ES_H_7: IC274.13(2C3)
ES_H_WRT: IC324.1(G)
ES_L_0: IC6.2(D2) IC44.2(D2) IC85.2(D2) IC108.2(D2) IC122.2(D2) IC176.2(D2) IC182.2(D2) IC282.3(1C3)
ES_L_1: IC189.2(D2) IC282.13(2C3)
ES_L_2: IC279.3(1C3)
ES_L_3: IC279.13(2C3)
ES_L_4: IC280.3(1C3)
ES_L_5: IC280.13(2C3)
ES_L_6: IC281.3(1C3)
ES_L_7: IC281.13(2C3)
FINAL_CONDITION: IC43.3(B:I) IC175.6(B:O)
FINAL_MEM_IO: IC69.5(B:Y3) RN4.14
FINAL_RD: IC69.9(B:Y1) RN4.16
FINAL_WR: IC69.7(B:Y2) RN4.15
FLAGS_0: IC193.2(D2)
GND: AUX_FLAGS_H1.9(G1) AUX_FLAGS_H1.10(G2) AUX_FLAGS_L1.9(G1) AUX_FLAGS_L1.10(G2) FLAGS.13(D5) FLAGS.14(D6) FLAGS.17(D7) FLAGS.18(D8) IC7.15(G) IC9.9(G1) IC9.10(G2) IC13.4(D0) IC13.7(G) IC13.12(D7) IC13.13(D6) IC14.15(G) IC15.15(G) IC16.4(D0) IC16.7(G) IC16.12(D7) IC16.13(D6) IC16.14(D5) IC17.1(G1) IC17.19(G2) IC24.15(G) IC26.3(A2) IC26.5(A1) IC26.12(A4) IC26.14(A3) IC27.9(G1) IC27.10(G2) IC49.5(2A) IC49.11(3A) IC49.14(4A) IC49.15(G) IC50.7(C0) IC55.2(1A) IC55.5(2A) IC55.11(3A) IC55.14(4A) IC55.15(G) IC56.3(A2) IC56.5(A1) IC56.12(A4) IC56.14(A3) IC62.3(A2) IC62.5(A1) IC62.12(A4) IC62.14(A3) IC63.2(1A) IC63.5(2A) IC63.11(3A) IC63.14(4A) IC63.15(G) IC68.2(1A) IC68.5(2A) IC68.11(3A) IC68.14(4A) IC68.15(G) IC69.17(B:A4) IC94.15(G) IC142.3(D1) IC148.15(G) IC155.1(1G) IC155.15(2G) IC156.1(1G) IC156.15(2G) IC159.3(D1) IC160.3(D1) IC178.7(G) IC186.3(D1) IC226.5(EI) IC237.3(1C3) IC255.4(1C2) IC262.11(C:I2) IC270.3(1C3) IC271.7(C0) IC283.2(B2) IC283.6(B1) IC283.11(B4) IC283.15(B3) IC284.2(B2) IC284.6(B1) IC284.11(B4) IC284.15(B3) IC285.3(A2) IC285.5(A1) IC285.7(C0) IC285.12(A4) IC285.14(A3) IC286.2(B2) IC286.6(B1) IC286.11(B4) IC286.15(B3) IC287.2(B2) IC287.6(B1) IC287.11(B4) IC287.15(B3) IC310.7(C0) IC412.9(G1) IC412.10(G2) INT_CODE_REG.4(2D) INT_CODE_REG.7(3D) INT_CODE_REG.17(7D) INT_CODE_REG.18(8D) R1.1 R5.1 R6.1 R7.1 R8.1 R10.1 R11.1 R12.1 R13.1 S3.2(P) S5.3(S) S6.3(S) U$1.20(/CE) U$1.22(/OE) U$1.27(/WE) U$2.20(/CE) U$2.22(/OE) U$2.27(/WE) U$3.20(/CE) U$3.22(/OE) U$3.27(/WE) U$4.20(/CE) U$4.22(/OE) U$4.27(/WE) U$5.20(/CE) U$5.22(/OE) U$5.27(/WE) U$6.20(/CE) U$6.22(/OE) U$6.27(/WE) U$7.20(/CE) U$7.22(/OE) U$7.27(/WE) U$8.20(/CE) U$8.22(/OE) U$8.27(/WE) U$9.20(/CE) U$9.22(/OE) U$9.27(/WE) U$13.1(A14) U$13.14(GND) U$13.20(/CE) U$13.22(/OE) U$13.27(/WE) U$14.1(A14) U$14.14(GND) U$14.20(/CE) U$14.22(/OE) U$14.27(/WE) U$15.1(A14) U$15.14(GND) U$15.20(/CE) U$15.22(/OE) U$15.27(/WE) U$16.1(A14) U$16.14(GND) U$16.20(/CE) U$16.22(/OE) U$16.27(/WE) U_DMA_SW_H.9 U_DMA_SW_H.10 U_DMA_SW_H.11 U_DMA_SW_H.12 U_DMA_SW_H.13 U_DMA_SW_H.14 U_DMA_SW_H.15 U_DMA_SW_H.16 U_DMA_SW_L.9 U_DMA_SW_L.10 U_DMA_SW_L.11 U_DMA_SW_L.12 U_DMA_SW_L.13 U_DMA_SW_L.14 U_DMA_SW_L.15 U_DMA_SW_L.16 U_FETCH_SW_H.9 U_FETCH_SW_H.10 U_FETCH_SW_H.11 U_FETCH_SW_H.12 U_FETCH_SW_H.13 U_FETCH_SW_H.14 U_FETCH_SW_H.15 U_FETCH_SW_H.16 U_FETCH_SW_L.9 U_FETCH_SW_L.10 U_FETCH_SW_L.11 U_FETCH_SW_L.12 U_FETCH_SW_L.13 U_FETCH_SW_L.14 U_FETCH_SW_L.15 U_FETCH_SW_L.16 U_INT_SW_H.9 U_INT_SW_H.10 U_INT_SW_H.11 U_INT_SW_H.12 U_INT_SW_H.13 U_INT_SW_H.14 U_INT_SW_H.15 U_INT_SW_H.16 U_INT_SW_L.9 U_INT_SW_L.10 U_INT_SW_L.11 U_INT_SW_L.12 U_INT_SW_L.13 U_INT_SW_L.14 U_INT_SW_L.15 U_INT_SW_L.16 U_TRAP_SW_H.9 U_TRAP_SW_H.10 U_TRAP_SW_H.11 U_TRAP_SW_H.12 U_TRAP_SW_H.13 U_TRAP_SW_H.14 U_TRAP_SW_H.15 U_TRAP_SW_H.16 U_TRAP_SW_L.9 U_TRAP_SW_L.10 U_TRAP_SW_L.11 U_TRAP_SW_L.12 U_TRAP_SW_L.13 U_TRAP_SW_L.14 U_TRAP_SW_L.15 U_TRAP_SW_L.16
HALT: AUX_FLAGS_H1.4(Q2) IC415.5(B:I1)
IMM_ADDR_0: IC271.6(B1)
IMM_ADDR_1: IC271.2(B2)
IMM_ADDR_2: IC271.15(B3)
IMM_ADDR_3: IC271.11(B4)
IMM_ADDR_4: IC288.2(B2) IC288.6(B1) IC288.11(B4) IC288.15(B3) IC289.2(B2) IC289.6(B1) IC289.11(B4) IC289.15(B3) IC290.2(B2) IC290.6(B1) IC290.11(B4) IC290.15(B3)
IMMY_0: IC98.4(D0)
IN_TRAP: AUX_FLAGS_H1.3(Q1) IC47.3(B:I) IC234.3(B:I)
INT_ACK: IC92.3(B:I)
INT_CODE_0: IC193.13(D6) IC222.1(A) INT_CODE_REG.9(4Q)
INT_CODE_1: IC222.2(B) IC226.7(A1) INT_CODE_REG.12(5Q) INT_CODE_REG.13(5D)
INT_CODE_2: IC222.3(C) IC226.6(A2) INT_CODE_REG.14(6D) INT_CODE_REG.15(6Q)
INT_DMA_CODE_WRT: INT_CODE_REG.1(G)
INT_ENABLE: AUX_FLAGS_L1.5(Q3) IC240.4(A:I2)
INT_PENDING: IC45.2(A:I1) IC141.9(C:I0) IC239.4(B:O)
INT_REQ_0: IC8.3(A:CLK) IC67.1(A:I0) R5.2
INT_REQ_1: IC161.1(A:I0) IC163.3(A:CLK) R6.2
INT_REQ_2: IC164.3(A:CLK) IC196.1(A:I0) R7.2
INT_REQ_3: IC168.3(A:CLK) IC211.1(A:I0) R8.2
INT_REQ_4: IC174.3(A:CLK) R10.2
INT_REQ_5: IC188.3(A:CLK) R11.2
INT_REQ_6: IC221.3(A:CLK) R12.2
INT_REQ_7: IC187.3(A:CLK) R13.2
INT_STATUS_REG_0: IC193.14(D5)
IR_0: IC129.3(D1) IC169.2(1Q)
IR_1: IC73.3(D1) IC169.5(2Q)
IR_2: IC34.3(D1) IC169.6(3Q)
IR_3: IC35.3(D1) IC169.9(4Q)
IR_4: IC36.3(D1) IC169.12(5Q)
IR_5: IC37.3(D1) IC169.15(6Q)
IR_6: IC38.3(D1) IC169.16(7Q)
IR_7: IC40.3(D1) IC169.19(8Q)
IR_8: IC41.3(D1) IC118.2(1Q)
IR_9: IC71.3(D1) IC118.5(2Q)
IR_10: IC20.3(D1) IC118.6(3Q)
IR_11: IC118.9(4Q) IC172.3(D1)
IR_H_WRT: IC118.1(G)
IR_L_WRT: IC169.1(G)
MAR_0: IC265.5(1C1)
MAR_1: IC265.11(2C1)
MAR_H_0: IC2.1(D3) IC29.1(D3) IC81.1(D3) IC100.1(D3) IC114.1(D3) IC145.1(D3) IC179.1(D3)
MAR_H_1: IC184.1(D3)
MAR_L_0: IC2.2(D2) IC29.2(D2) IC81.2(D2) IC100.2(D2) IC114.2(D2) IC145.2(D2) IC179.2(D2) IC299.5(1C1)
MAR_L_1: IC184.2(D2)
MARH_WRT: IC57.1(G)
MARL_WRT: IC48.1(G)
MASK_0: IC9.3(Q1) IC82.9(C:I0)
MASK_1: IC9.4(Q2) IC152.9(C:I0)
MASK_2: IC9.5(Q3) IC201.9(C:I0)
MASK_3: IC9.6(Q4) IC203.9(C:I0)
MASK_4: IC27.3(Q1) IC206.9(C:I0)
MASK_5: IC27.4(Q2) IC228.9(C:I0)
MASK_6: IC27.5(Q3) IC190.9(C:I0)
MASK_7: IC27.6(Q4) IC242.9(C:I0)
MASK_ENABLE: AUX_FLAGS_L1.6(Q4) IC82.10(C:I1) IC152.10(C:I1) IC190.10(C:I1) IC201.10(C:I1) IC203.10(C:I1) IC206.10(C:I1) IC228.10(C:I1) IC242.10(C:I1)
MASK_FLAGS_0: IC193.15(D4)
MASK_FLAGS_WRT: IC9.1(M) IC9.2(N) IC27.1(M) IC27.2(N)
MDR_DATA_OUT: IC131.1(1G) IC131.15(2G) IC138.1(1G) IC138.15(2G) IC263.1(1G) IC263.15(2G) IC264.1(1G) IC264.15(2G)
MDR_DATA_OUT_SRC_0: IC138.14(A)
MDR_DATA_OUT_SRC_1: IC138.2(B)
MDR_IN_BUS1: IC19.3(1D) IC96.3(1D)
MDR_IN_BUS2: IC19.4(2D) IC96.4(2D)
MDR_IN_BUS3: IC19.7(3D) IC96.7(3D)
MDR_IN_BUS4: IC19.8(4D) IC96.8(4D)
MDR_IN_BUS5: IC19.13(5D) IC96.13(5D)
MDR_IN_BUS6: IC19.14(6D) IC96.14(6D)
MDR_IN_BUS7: IC19.17(7D) IC96.17(7D)
MDR_IN_BUS8: IC258.3(1D) IC291.3(1D)
MDR_IN_BUS9: IC258.4(2D) IC291.4(2D)
MDR_IN_BUS10: IC258.7(3D) IC291.7(3D)
MDR_IN_BUS11: IC258.8(4D) IC291.8(4D)
MDR_IN_BUS12: IC258.13(5D) IC291.13(5D)
MDR_IN_BUS13: IC258.14(6D) IC291.14(6D)
MDR_IN_BUS14: IC258.17(7D) IC291.17(7D)
MDR_IN_BUS15: IC258.18(8D) IC291.18(8D)
MDR_IN_BUS16: IC19.18(8D) IC96.18(8D)
MDRH_H_0: IC19.2(1Q) IC98.13(D6) IC208.12(D7)
MDRH_H_1: IC19.5(2Q)
MDRH_H_2: IC19.6(3Q)
MDRH_H_3: IC19.9(4Q)
MDRH_H_4: IC19.12(5Q)
MDRH_H_5: IC19.15(6Q)
MDRH_H_6: IC19.16(7Q)
MDRH_H_7: IC19.19(8Q)
MDRH_H_WRT: IC19.1(G)
MDRH_IN_SRC: IC94.1(!A!/B) IC148.1(!A!/B)
MDRH_L_0: IC96.2(1Q) IC98.14(D5) IC208.13(D6)
MDRH_L_1: IC96.5(2Q)
MDRH_L_2: IC96.6(3Q)
MDRH_L_3: IC96.9(4Q)
MDRH_L_4: IC96.12(5Q)
MDRH_L_5: IC96.15(6Q)
MDRH_L_6: IC96.16(7Q)
MDRH_L_7: IC96.19(8Q)
MDRH_L_WRT: IC96.1(G)
MDRL_H_0: IC98.15(D4) IC208.14(D5) IC258.2(1Q)
MDRL_H_1: IC258.5(2Q)
MDRL_H_2: IC258.6(3Q)
MDRL_H_3: IC258.9(4Q)
MDRL_H_4: IC258.12(5Q)
MDRL_H_5: IC258.15(6Q)
MDRL_H_6: IC258.16(7Q)
MDRL_H_7: IC258.19(8Q)
MDRL_H_WRT: IC258.1(G)
MDRL_IN_SRC: IC7.1(!A!/B) IC24.1(!A!/B)
MDRL_L_0: IC98.1(D3) IC208.15(D4) IC291.2(1Q)
MDRL_L_1: IC291.5(2Q)
MDRL_L_2: IC291.6(3Q)
MDRL_L_3: IC291.9(4Q)
MDRL_L_4: IC291.12(5Q)
MDRL_L_5: IC291.15(6Q)
MDRL_L_6: IC291.16(7Q)
MDRL_L_7: IC291.19(8Q)
MDRL_L_WRT: IC291.1(G)
MEM_IO: IC60.6(Q3) IC69.15(B:A3)
MUX_A: IC213.3(A:O)
MUX_B: IC235.8(C:O)
MUX_C: IC61.2(A:O)
N$1: IC198.1(A:I) IC261.12(A:O)
N$2: IC198.2(A:O) IC261.3(B:I0)
N$3: IC197.1(A:I) IC261.6(B:O)
N$4: IC197.2(A:O) IC261.9(C:I0)
N$5: IC199.1(A:I) IC261.8(C:O)
N$6: IC199.2(A:O) IC262.9(C:I0)
N$7: IC22.2(A:O) IC170.4(B:I0)
N$8: IC22.1(A:I) IC66.6(B:O)
N$10: IC80.6(B:O) IC133.2(A:I1)
N$11: IC46.3(A:O) IC155.3(1C3)
N$12: IC49.4(1Y) IC50.6(B1)
N$13: IC66.4(B:I0) IC112.2(A:O)
N$14: IC49.7(2Y) IC50.2(B2)
N$15: IC65.1(A:I) IC97.6(B:O)
N$16: IC99.1(A:I) IC104.6(B:O)
N$17: IC105.12(A:O) IC112.1(A:I)
N$18: IC62.15(B3) IC266.7(1Y)
N$19: IC26.2(B2) IC267.9(2Y)
N$20: IC106.3(1D) IC300.4(1Y)
N$21: IC106.4(2D) IC300.7(2Y)
N$22: IC15.13(4B) IC16.5(Y)
N$23: IC65.2(A:O) IC105.1(A:I0)
N$24: IC143.3(A:O) IC170.5(B:I1)
N$25: IC1.4(1Y) IC48.3(1D) IC102.3(1D) IC165.3(1D) IC260.3(1D)
N$26: IC1.7(2Y) IC48.4(2D) IC102.4(2D) IC165.4(2D) IC260.4(2D)
N$27: IC1.9(3Y) IC48.7(3D) IC102.7(3D) IC165.7(3D) IC260.7(3D)
N$28: IC1.12(4Y) IC48.8(4D) IC102.8(4D) IC165.8(4D) IC260.8(4D)
N$29: IC48.13(5D) IC102.13(5D) IC165.13(5D) IC230.4(1Y) IC260.13(5D)
N$30: IC48.14(6D) IC102.14(6D) IC165.14(6D) IC230.7(2Y) IC260.14(6D)
N$31: IC48.17(7D) IC102.17(7D) IC165.17(7D) IC230.9(3Y) IC260.17(7D)
N$32: IC42.8(C:O) IC43.5(C:I)
N$33: IC10.7(CN) IC13.5(Y)
N$34: IC99.2(A:O) IC141.2(A:I1)
N$35: IC49.9(3Y) IC50.15(B3)
N$36: IC49.12(4Y) IC50.11(B4)
N$37: IC51.6(B1) IC55.4(1Y)
N$38: IC51.2(B2) IC55.7(2Y)
N$39: IC51.15(B3) IC55.9(3Y)
N$40: IC51.11(B4) IC55.12(4Y)
N$41: FLAGS.3(D1) IC241.7(1Y)
N$42: IC10.16(CN+4) IC11.7(CN)
N$43: IC14.4(1Y) IC17.2(A1)
N$44: IC12.2(A:O) IC13.1(D3)
N$45: IC13.14(D5) IC21.2(A:O)
N$46: IC14.7(2Y) IC17.3(A2)
N$47: IC14.9(3Y) IC17.4(A3)
N$48: IC14.12(4Y) IC17.5(A4)
N$49: IC234.4(B:O) IC240.5(A:I3)
N$50: IC66.5(B:I1) IC130.6(B:O) IC143.2(A:I1)
N$51: IC15.4(1Y) IC17.6(A5)
N$52: IC7.4(1Y)
N$53: IC7.7(2Y)
N$54: IC7.9(3Y)
N$55: IC7.12(4Y)
N$56: IC24.4(1Y)
N$57: IC24.7(2Y)
N$58: IC24.9(3Y)
N$59: IC24.12(4Y)
N$60: IC7.3(1B)
N$61: IC7.6(2B)
N$62: IC7.10(3B)
N$63: IC7.13(4B)
N$64: IC24.3(1B)
N$65: IC52.6(B1) IC63.4(1Y)
N$66: FLAGS.19(Q8)
N$67: IC24.6(2B)
N$68: IC24.10(3B)
N$69: IC24.13(4B)
N$70: IC23.15(D4) IC25.3(A:O)
N$71: IC48.18(8D) IC102.18(8D) IC165.18(8D) IC230.12(4Y) IC260.18(8D)
N$72: IC1.3(1B) IC271.4(S1)
N$73: IC1.6(2B) IC271.1(S2)
N$74: IC52.2(B2) IC63.7(2Y)
N$75: IC52.15(B3) IC63.9(3Y)
N$77: IC75.3(D1) U$1.11(I/O0)
N$78: IC61.1(A:I) IC144.6(A:O)
N$79: IC32.3(D1) IC186.5(Y)
N$80: IC42.11(C:I2) IC43.4(B:O)
N$81: IC53.15(B3) IC68.9(3Y)
N$82: IC106.7(3D) IC300.9(3Y)
N$83: IC15.7(2Y) IC17.7(A6)
N$84: IC133.1(A:I0) IC170.6(B:O)
N$85: IC106.8(4D) IC300.12(4Y)
N$86: IC167.6(B:O) IC178.14(D5)
N$87: IC57.3(1D) IC101.3(1D) IC173.3(1D) IC245.3(1D) IC256.4(1Y)
N$88: FLAGS.4(D2) IC243.7(1Y)
N$89: IC141.12(A:O) IC143.1(A:I0)
N$90: FLAGS.7(D3) IC255.7(1Y)
N$91: IC53.11(B4) IC68.12(4Y)
N$92: FLAGS.8(D4) IC23.5(Y)
N$93: IC153.6(B:O) IC178.12(D7)
N$94: IC213.1(A:I0) IC214.6(B:O)
N$95: IC39.1(A:CLR) IC147.1(A:O)
N$96: IC231.3(D1) IC237.7(1Y)
N$97: IC32.4(D2) IC160.5(Y)
N$98: IC231.4(D2) IC270.7(1Y)
N$99: IC236.3(A:O) IC237.4(1C2)
N$100: IC127.4(1Y) IC231.8(D4)
N$101: IC121.4(1Y) IC231.7(D3)
N$102: IC126.4(B:O) IC413.3(A:CLK)
N$103: IC1.10(3B) IC271.13(S3)
N$104: IC1.13(4B) IC271.10(S4)
N$105: AUX_FLAGS_H1.6(Q4)
N$106: IC57.4(2D) IC101.4(2D) IC173.4(2D) IC245.4(2D) IC256.7(2Y)
N$107: IC15.9(3Y) IC17.8(A7)
N$108: IC39.5(A:Q) IC141.4(B:I1)
N$109: IC57.7(3D) IC101.7(3D) IC173.7(3D) IC245.7(3D) IC256.9(3Y)
N$110: IC57.8(4D) IC101.8(4D) IC173.8(4D) IC245.8(4D) IC256.12(4Y)
N$111: IC57.13(5D) IC101.13(5D) IC173.13(5D) IC245.13(5D) IC259.4(1Y)
N$112: IC57.14(6D) IC101.14(6D) IC173.14(6D) IC245.14(6D) IC259.7(2Y)
N$113: IC32.7(D3) IC159.5(Y)
N$114: IC56.7(C0) IC285.9(C4)
N$115: IC56.6(B1) IC277.7(1Y)
N$116: IC56.2(B2) IC277.9(2Y)
N$117: IC56.15(B3) IC278.7(1Y)
N$118: IC56.11(B4) IC278.9(2Y)
N$119: IC56.4(S1) IC302.6(A5)
N$120: IC56.1(S2) IC302.7(A6)
N$121: IC56.13(S3) IC302.8(A7)
N$122: IC56.10(S4) IC302.9(A8)
N$123: IC283.4(S1) IC303.2(A1)
N$124: IC283.1(S2) IC303.3(A2)
N$125: IC283.13(S3) IC303.4(A3)
N$126: IC283.10(S4) IC303.5(A4)
N$127: IC284.4(S1) IC303.6(A5)
N$128: IC284.1(S2) IC303.7(A6)
N$129: IC284.13(S3) IC303.8(A7)
N$130: IC214.4(B:I0) IC229.3(A:O)
N$131: IC64.10(C:I1) INT_STATUS_REG.2(Q1)
N$132: IC15.12(4Y) IC17.9(A8)
N$133: IC64.9(C:I0) IC82.8(C:O)
N$134: IC230.3(1B) IC288.4(S1)
N$135: IC57.17(7D) IC101.17(7D) IC173.17(7D) IC245.17(7D) IC259.9(3Y)
N$136: IC57.18(8D) IC101.18(8D) IC173.18(8D) IC245.18(8D) IC259.12(4Y)
N$137: IC230.6(2B) IC288.1(S2)
N$138: IC230.10(3B) IC288.13(S3)
N$139: IC94.4(1Y)
N$140: IC230.13(4B) IC288.10(S4)
N$141: IC256.3(1B) IC289.4(S1)
N$142: IC256.6(2B) IC289.1(S2)
N$143: IC256.10(3B) IC289.13(S3)
N$144: IC52.11(B4) IC63.12(4Y)
N$145: IC53.6(B1) IC68.4(1Y)
N$146: IC256.13(4B) IC289.10(S4)
N$147: IC53.2(B2) IC68.7(2Y)
N$148: IC259.3(1B) IC290.4(S1)
N$149: IC259.6(2B) IC290.1(S2)
N$150: IC8.5(A:Q) IC67.2(A:I1)
N$151: IC259.10(3B) IC290.13(S3)
N$152: IC43.6(C:O) IC49.1(!A!/B) IC55.1(!A!/B) IC63.1(!A!/B) IC68.1(!A!/B)
N$153: IC32.8(D4) IC142.5(Y)
N$154: IC42.10(C:I1) IC43.2(A:O)
N$155: IC106.13(5D) IC301.4(1Y)
N$156: IC259.13(4B) IC290.10(S4)
N$157: IC271.9(C4) IC288.7(C0)
N$158: IC288.9(C4) IC289.7(C0)
N$159: IC289.9(C4) IC290.7(C0)
N$160: IC271.5(A1) IC299.7(1Y)
N$161: IC271.3(A2) IC299.9(2Y)
N$162: IC271.14(A3) IC298.7(1Y)
N$163: IC271.12(A4) IC298.9(2Y)
N$164: IC288.5(A1) IC292.7(1Y)
N$165: IC288.3(A2) IC292.9(2Y)
N$166: IC288.14(A3) IC293.7(1Y)
N$168: IC288.12(A4) IC293.9(2Y)
N$169: IC289.5(A1) IC294.7(1Y)
N$170: IC289.3(A2) IC294.9(2Y)
N$171: IC289.14(A3) IC295.7(1Y)
N$172: IC289.12(A4) IC295.9(2Y)
N$173: IC43.8(D:O) IC144.2(A:I1) IC229.2(A:I1) IC235.10(C:I1)
N$174: IC32.13(D5) IC129.5(Y)
N$175: IC32.14(D6) IC73.5(Y)
N$176: IC290.5(A1) IC296.7(1Y)
N$177: IC290.3(A2) IC296.9(2Y)
N$178: IC290.14(A3) IC297.7(1Y)
N$179: IC290.12(A4) IC297.9(2Y)
N$180: IC106.14(6D) IC301.7(2Y)
N$181: IC94.7(2Y)
N$182: IC94.9(3Y)
N$183: IC94.12(4Y)
N$184: IC148.4(1Y)
N$185: IC32.17(D7) IC34.5(Y)
N$186: IC32.18(D8) IC35.5(Y)
N$187: IC33.3(D1) IC36.5(Y)
N$188: IC33.4(D2) IC37.5(Y)
N$189: IC33.7(D3) IC38.5(Y)
N$190: IC33.8(D4) IC40.5(Y)
N$191: IC148.7(2Y)
N$192: IC148.9(3Y)
N$193: IC148.12(4Y)
N$194: IC94.3(1B)
N$195: IC94.6(2B)
N$196: IC94.10(3B)
N$197: IC94.13(4B)
N$198: IC148.3(1B)
N$199: IC148.6(2B)
N$200: IC148.10(3B)
N$201: IC148.13(4B)
N$202: FLAGS.12(Q5)
N$203: IC18.18(D8) U$13.19(I/O7)
N$204: IC18.17(D7) U$13.18(I/O6)
N$205: IC18.14(D6) U$13.17(I/O5)
N$206: IC18.13(D5) U$13.16(I/O4)
N$207: IC18.8(D4) U$13.15(I/O3)
N$208: IC18.7(D3) U$13.13(I/O2)
N$209: IC18.4(D2) U$13.12(I/O1)
N$210: IC18.3(D1) U$13.11(I/O0)
N$211: IC70.3(D1) U$14.11(I/O0)
N$212: IC70.4(D2) U$14.12(I/O1)
N$213: IC70.7(D3) U$14.13(I/O2)
N$214: IC70.8(D4) U$14.15(I/O3)
N$215: IC70.13(D5) U$14.16(I/O4)
N$216: IC70.14(D6) U$14.17(I/O5)
N$217: IC70.17(D7) U$14.18(I/O6)
N$218: IC33.13(D5) IC41.5(Y)
N$219: IC33.14(D6) IC71.5(Y)
N$220: IC67.3(A:O) INT_STATUS_REG.3(D1)
N$221: IC299.11(2C1)
N$222: IC195.2(A:I1) IC222.15(Y0)
N$223: IC8.1(A:CLR) IC195.3(A:O)
N$224: IC70.18(D8) U$14.19(I/O7)
N$225: IC20.5(Y) IC33.17(D7)
N$226: IC64.8(C:O) IC226.4
N$227: IC72.3(D1) U$15.11(I/O0)
N$228: IC33.18(D8) IC172.5(Y)
N$229: IC299.12(2C2)
N$230: IC299.13(2C3)
N$231: IC120.3(A:O) IC241.4(1C2)
N$232: IC72.4(D2) U$15.12(I/O1)
N$233: IC72.7(D3) U$15.13(I/O2)
N$234: IC106.17(7D) IC301.9(3Y)
N$235: IC298.5(1C1)
N$236: IC298.4(1C2)
N$237: IC298.3(1C3)
N$238: IC106.18(8D) IC301.12(4Y)
N$239: IC298.11(2C1)
N$240: IC298.12(2C2)
N$241: IC298.13(2C3)
N$242: IC31.3(1D) IC304.4(1Y)
N$243: IC292.5(1C1)
N$244: IC292.4(1C2)
N$245: IC292.3(1C3)
N$246: IC31.4(2D) IC304.7(2Y)
N$247: IC292.11(2C1)
N$248: IC292.12(2C2)
N$249: IC292.13(2C3)
N$250: IC31.7(3D) IC304.9(3Y)
N$251: U$2.10(A0)
N$252: U$2.9(A1)
N$253: U$2.8(A2)
N$254: U$2.7(A3)
N$255: U$2.6(A4)
N$256: U$2.5(A5)
N$257: U$2.4(A6)
N$258: U$2.3(A7)
N$259: U$2.25(A8)
N$260: U$2.24(A9)
N$261: U$2.21(A10)
N$262: U$2.23(A11)
N$263: U$2.2(A12)
N$264: U$2.26(A13)
N$265: U$3.10(A0)
N$266: U$3.9(A1)
N$267: U$3.8(A2)
N$268: U$3.7(A3)
N$269: U$3.6(A4)
N$270: U$3.5(A5)
N$271: U$3.4(A6)
N$272: U$3.3(A7)
N$273: U$3.25(A8)
N$274: U$3.24(A9)
N$275: U$3.21(A10)
N$276: U$3.23(A11)
N$277: U$3.2(A12)
N$278: U$3.26(A13)
N$279: U$4.10(A0)
N$280: U$4.9(A1)
N$281: U$4.8(A2)
N$282: U$4.7(A3)
N$283: U$4.6(A4)
N$284: U$4.5(A5)
N$285: U$4.4(A6)
N$286: U$4.3(A7)
N$287: U$4.25(A8)
N$288: U$4.24(A9)
N$289: U$4.21(A10)
N$290: U$4.23(A11)
N$291: U$4.2(A12)
N$292: U$4.26(A13)
N$293: U$5.10(A0)
N$294: U$5.9(A1)
N$295: U$5.8(A2)
N$296: U$5.7(A3)
N$297: U$5.6(A4)
N$298: U$5.5(A5)
N$299: U$5.4(A6)
N$300: U$5.3(A7)
N$301: U$5.25(A8)
N$302: U$5.24(A9)
N$303: U$5.21(A10)
N$304: U$5.23(A11)
N$305: U$5.2(A12)
N$306: U$5.26(A13)
N$307: IC293.5(1C1)
N$308: IC293.4(1C2)
N$309: IC293.3(1C3)
N$310: IC31.8(4D) IC304.12(4Y)
N$311: IC293.11(2C1)
N$312: IC72.8(D4) U$15.15(I/O3)
N$313: IC72.13(D5) U$15.16(I/O4)
N$314: IC72.14(D6) U$15.17(I/O5)
N$315: IC293.12(2C2)
N$316: IC72.17(D7) U$15.18(I/O6)
N$317: IC72.18(D8) U$15.19(I/O7)
N$318: IC74.3(D1) U$16.11(I/O0)
N$319: IC74.4(D2) U$16.12(I/O1)
N$320: IC226.9(A0) INT_CODE_REG.8(4D)
N$321: IC74.7(D3) U$16.13(I/O2)
N$322: IC74.8(D4) U$16.15(I/O3)
N$323: IC74.13(D5) U$16.16(I/O4)
N$324: IC74.14(D6) U$16.17(I/O5)
N$325: IC293.13(2C3)
N$326: IC31.13(5D) IC305.4(1Y)
N$327: IC294.5(1C1)
N$328: IC294.4(1C2)
N$329: IC294.3(1C3)
N$330: IC31.14(6D) IC305.7(2Y)
N$331: IC294.11(2C1)
N$332: IC294.12(2C2)
N$333: IC50.5(A1)
N$334: IC50.3(A2)
N$335: IC50.14(A3)
N$336: IC50.12(A4)
N$337: IC52.5(A1)
N$338: IC51.5(A1)
N$339: IC51.3(A2)
N$340: IC51.14(A3)
N$341: IC51.12(A4)
N$342: IC294.13(2C3)
N$343: IC74.17(D7) U$16.18(I/O6)
N$344: IC31.17(7D) IC305.9(3Y)
N$345: IC295.5(1C1)
N$346: IC158.9(C:I0) IC190.8(C:O)
N$347: IC74.18(D8) U$16.19(I/O7)
N$348: U$1.1(A14) U$1.14(GND) U$2.1(A14) U$2.14(GND) U$3.1(A14) U$3.14(GND) U$4.1(A14) U$4.14(GND) U$5.1(A14) U$5.14(GND) U$6.1(A14) U$6.14(GND) U$7.1(A14) U$7.14(GND) U$8.1(A14) U$8.14(GND) U$9.1(A14) U$9.14(GND)
N$349: IC149.3(B:I) IC226.14(GS)
N$350: IC52.3(A2)
N$351: IC52.14(A3)
N$352: IC52.12(A4)
N$353: IC53.5(A1)
N$354: IC53.3(A2)
N$355: IC158.8(C:O) IC226.11
N$356: IC149.4(B:O) IC240.2(A:I1)
N$357: IC50.9(C4) IC51.7(C0)
N$358: IC51.9(C4) IC52.7(C0)
N$359: IC52.9(C4) IC53.7(C0)
N$360: IC76.5(Q2)
N$361: IC226.15(EO) IC240.1(A:I0)
N$362: IC2.5(Y) IC3.6(1C0)
N$363: IC295.4(1C2)
N$364: IC76.6(Q3)
N$365: IC93.8(C:O) IC226.3
N$366: IC93.10(C:I1) INT_STATUS_REG.5(Q2)
N$367: IC75.4(D2) U$1.12(I/O1)
N$368: IC132.9(C:I0) IC201.8(C:O)
N$369: IC75.7(D3) U$1.13(I/O2)
N$370: IC295.3(1C3)
N$371: IC31.18(8D) IC305.12(4Y)
N$372: IC168.1(A:CLR) IC220.3(A:O)
N$373: IC295.11(2C1)
N$374: IC174.1(A:CLR) IC223.3(A:O)
N$375: IC75.8(D4) U$1.15(I/O3)
N$376: IC75.13(D5) U$1.16(I/O4)
N$377: IC75.14(D6) U$1.17(I/O5)
N$378: IC60.3(D1) U$10.11(I/O0)
N$379: IC60.4(D2) U$10.12(I/O1)
N$380: IC60.7(D3) U$10.13(I/O2)
N$381: IC60.8(D4) U$10.15(I/O3)
N$382: IC60.13(D5) U$10.16(I/O4)
N$383: IC60.14(D6) U$10.17(I/O5)
N$384: IC60.17(D7) U$10.18(I/O6)
N$385: IC60.18(D8) U$10.19(I/O7)
N$386: IC3.5(1C1) IC5.5(Y)
N$387: IC3.4(1C2) IC6.5(Y)
N$388: IC188.1(A:CLR) IC224.3(A:O)
N$389: IC187.5(A:Q)
N$390: IC161.3(A:O)
N$391: IC76.9(Q4)
N$392: IC196.3(A:O)
N$393: IC211.3(A:O)
N$394: IC174.5(A:Q)
N$395: IC188.5(A:Q)
N$396: IC221.5(A:Q)
N$397: IC207.1(A:I0) IC222.7(Y7)
N$398: IC218.2(A:I1) IC222.14(Y1)
N$399: IC219.2(A:I1) IC222.13(Y2)
N$400: IC76.12(Q5)
N$401: IC76.15(Q6)
N$402: IC76.16(Q7)
N$403: IC222.11(Y4) IC223.1(A:I0)
N$404: IC113.2(1A) IC180.7(1Y)
N$405: IC222.9(Y6) IC225.1(A:I0)
N$406: IC187.1(A:CLR) IC207.3(A:O)
N$407: IC295.12(2C2)
N$408: IC163.1(A:CLR) IC218.3(A:O)
N$409: IC164.1(A:CLR) IC219.3(A:O)
N$410: IC221.1(A:CLR) IC225.3(A:O)
N$411: IC132.10(C:I1) INT_STATUS_REG.6(Q3)
N$412: IC150.10(C:I1) INT_STATUS_REG.9(Q4)
N$413: IC132.8(C:O) IC226.2
N$414: IC151.10(C:I1) INT_STATUS_REG.12(Q5)
N$415: IC150.9(C:I0) IC203.8(C:O)
N$416: IC150.8(C:O) IC226.1
N$417: IC151.9(C:I0) IC206.8(C:O)
N$418: IC151.8(C:O) IC226.13
N$419: IC157.9(C:I0) IC228.8(C:O)
N$420: IC157.8(C:O) IC226.12
N$421: IC191.9(C:I0) IC242.8(C:O)
N$422: IC295.13(2C3)
N$423: IC110.3(1D) IC306.4(1Y)
N$424: IC296.5(1C1)
N$425: IC296.4(1C2)
N$426: IC296.3(1C3)
N$427: IC110.4(2D) IC306.7(2Y)
N$428: IC296.11(2C1)
N$429: IC296.12(2C2)
N$430: IC296.13(2C3)
N$431: IC110.7(3D) IC306.9(3Y)
N$432: IC297.5(1C1)
N$433: IC297.4(1C2)
N$434: IC297.3(1C3)
N$435: IC310.9(C4) IC311.7(C0)
N$436: IC191.8(C:O) IC226.10
N$437: IC157.10(C:I1) INT_STATUS_REG.15(Q6)
N$438: IC158.10(C:I1) INT_STATUS_REG.16(Q7)
N$439: IC191.10(C:I1) INT_STATUS_REG.19(Q8)
N$440: IC76.19(Q8)
N$441: IC297.11(2C1)
N$442: IC76.3(D1) U$2.11(I/O0)
N$443: IC76.4(D2) U$2.12(I/O1)
N$444: IC168.5(A:Q) IC211.2(A:I1)
N$445: IC60.11(CLK)
N$446: IC311.9(C4) IC312.7(C0)
N$447: IC77.5(Q2)
N$448: IC3.10(2C0) IC29.5(Y)
N$449: IC75.17(D7) U$1.18(I/O6)
N$450: IC75.18(D8) U$1.19(I/O7)
N$451: IC76.7(D3) U$2.13(I/O2)
N$452: IC76.8(D4) U$2.15(I/O3)
N$453: IC76.13(D5) U$2.16(I/O4)
N$454: IC76.14(D6) U$2.17(I/O5)
N$455: IC76.17(D7) U$2.18(I/O6)
N$456: IC76.18(D8) U$2.19(I/O7)
N$457: IC77.3(D1) U$3.11(I/O0)
N$458: IC77.4(D2) U$3.12(I/O1)
N$459: IC77.7(D3) U$3.13(I/O2)
N$460: IC77.8(D4) U$3.15(I/O3)
N$461: IC77.13(D5) U$3.16(I/O4)
N$462: IC77.14(D6) U$3.17(I/O5)
N$463: IC77.17(D7) U$3.18(I/O6)
N$464: IC77.18(D8) U$3.19(I/O7)
N$465: IC78.3(D1) U$4.11(I/O0)
N$466: IC78.4(D2) U$4.12(I/O1)
N$467: IC78.7(D3) U$4.13(I/O2)
N$468: IC78.8(D4) U$4.15(I/O3)
N$469: IC78.13(D5) U$4.16(I/O4)
N$470: IC78.14(D6) U$4.17(I/O5)
N$471: IC78.17(D7) U$4.18(I/O6)
N$472: IC78.18(D8) U$4.19(I/O7)
N$473: IC79.3(D1) U$5.11(I/O0)
N$474: IC79.4(D2) U$5.12(I/O1)
N$475: IC79.7(D3) U$5.13(I/O2)
N$476: IC79.8(D4) U$5.15(I/O3)
N$477: IC79.13(D5) U$5.16(I/O4)
N$478: IC79.14(D6) U$5.17(I/O5)
N$479: IC79.17(D7) U$5.18(I/O6)
N$480: IC79.18(D8) U$5.19(I/O7)
N$481: IC312.9(C4) IC313.7(C0)
N$482: IC3.11(2C1) IC30.5(Y)
N$483: IC3.12(2C2) IC44.5(Y)
N$484: IC113.5(2A) IC180.9(2Y)
N$485: IC81.5(Y) IC83.6(1C0)
N$486: IC83.5(1C1) IC84.5(Y)
N$487: IC83.4(1C2) IC85.5(Y)
N$488: IC3.7(1Y) IC113.11(3A)
N$489: IC83.10(2C0) IC100.5(Y)
N$490: IC83.11(2C1) IC107.5(Y)
N$491: IC83.12(2C2) IC108.5(Y)
N$492: IC3.9(2Y) IC113.14(4A)
N$493: IC114.5(Y) IC115.6(1C0)
N$494: IC115.5(1C1) IC119.5(Y)
N$495: IC75.11(CLK)
N$496: IC75.1(CLR)
N$497: IC297.12(2C2)
N$498: IC297.13(2C3)
N$499: IC314.9(C4) IC315.7(C0)
N$500: IC315.9(C4) IC318.7(C0)
N$501: IC318.9(C4) IC319.7(C0)
N$502: IC300.3(1B) IC310.4(S1)
N$503: IC134.18(D8) U$6.19(I/O7)
N$504: IC134.17(D7) U$6.18(I/O6)
N$505: IC134.14(D6) U$6.17(I/O5)
N$506: IC134.13(D5) U$6.16(I/O4)
N$507: IC134.8(D4) U$6.15(I/O3)
N$508: IC134.7(D3) U$6.13(I/O2)
N$509: IC134.4(D2) U$6.12(I/O1)
N$510: IC134.3(D1) U$6.11(I/O0)
N$511: IC135.3(D1) U$7.11(I/O0)
N$512: IC135.4(D2) U$7.12(I/O1)
N$513: IC135.7(D3) U$7.13(I/O2)
N$514: IC135.8(D4) U$7.15(I/O3)
N$515: IC135.13(D5) U$7.16(I/O4)
N$516: IC135.14(D6) U$7.17(I/O5)
N$517: IC135.17(D7) U$7.18(I/O6)
N$518: IC135.18(D8) U$7.19(I/O7)
N$519: IC136.3(D1) U$8.11(I/O0)
N$520: IC136.4(D2) U$8.12(I/O1)
N$521: IC136.7(D3) U$8.13(I/O2)
N$522: IC136.8(D4) U$8.15(I/O3)
N$523: IC136.13(D5) U$8.16(I/O4)
N$524: IC136.14(D6) U$8.17(I/O5)
N$525: IC136.17(D7) U$8.18(I/O6)
N$526: IC136.18(D8) U$8.19(I/O7)
N$527: IC137.3(D1) U$9.11(I/O0)
N$530: IC300.6(2B) IC310.1(S2)
N$533: IC137.4(D2) U$9.12(I/O1)
N$534: IC137.7(D3) U$9.13(I/O2)
N$535: IC137.8(D4) U$9.15(I/O3)
N$536: IC137.13(D5) U$9.16(I/O4)
N$537: IC137.14(D6) U$9.17(I/O5)
N$538: IC137.17(D7) U$9.18(I/O6)
N$539: IC137.18(D8) U$9.19(I/O7)
N$540: IC300.10(3B) IC310.13(S3)
N$541: IC93.9(C:I0) IC152.8(C:O)
N$542: IC300.13(4B) IC310.10(S4)
N$543: IC301.3(1B) IC311.4(S1)
N$544: IC301.6(2B) IC311.1(S2)
N$545: IC301.10(3B) IC311.13(S3)
N$546: IC301.13(4B) IC311.10(S4)
N$547: IC304.3(1B) IC312.4(S1)
N$549: IC304.6(2B) IC312.1(S2)
N$550: IC304.10(3B) IC312.13(S3)
N$551: IC304.13(4B) IC312.10(S4)
N$552: IC305.3(1B) IC313.4(S1)
N$553: IC305.6(2B) IC313.1(S2)
N$554: IC305.10(3B) IC313.13(S3)
N$555: IC305.13(4B) IC313.10(S4)
N$556: IC83.7(1Y) IC128.2(1A)
N$557: IC83.9(2Y) IC128.5(2A)
N$558: IC115.7(1Y) IC128.11(3A)
N$559: IC115.9(2Y) IC128.14(4A)
N$560: IC4.4(A3) IC62.13(S3)
N$561: IC4.2(A1) IC62.4(S1)
N$562: IC4.3(A2) IC62.1(S2)
N$563: IC4.5(A4) IC62.10(S4)
N$564: IC77.6(Q3)
N$565: IC4.6(A5) IC26.4(S1)
N$566: IC4.7(A6) IC26.1(S2)
N$567: IC76.1(CLR)
N$568: IC77.9(Q4)
N$569: IC76.11(CLK)
N$570: IC4.8(A7) IC26.13(S3)
N$571: IC77.12(Q5)
N$572: IC4.9(A8) IC26.10(S4)
N$573: IC306.3(1B) IC314.4(S1)
N$574: IC284.10(S4) IC303.9(A8)
N$575: IC28.2(A1) IC286.4(S1)
N$576: IC28.3(A2) IC286.1(S2)
N$577: IC77.1(CLR)
N$578: IC77.11(CLK)
N$579: IC78.1(CLR)
N$580: IC78.11(CLK)
N$581: IC79.1(CLR)
N$582: IC79.11(CLK)
N$583: IC134.1(CLR)
N$584: IC134.11(CLK)
N$585: IC135.1(CLR)
N$586: IC135.11(CLK)
N$587: IC136.1(CLR)
N$588: IC136.11(CLK)
N$589: IC18.1(CLR)
N$590: IC18.11(CLK)
N$591: IC70.1(CLR)
N$592: IC70.11(CLK)
N$593: IC115.4(1C2) IC122.5(Y)
N$594: IC306.6(2B) IC314.1(S2)
N$595: IC115.10(2C0) IC145.5(Y)
N$596: IC115.11(2C1) IC146.5(Y)
N$597: IC115.12(2C2) IC176.5(Y)
N$598: IC306.10(3B) IC314.13(S3)
N$599: IC306.13(4B) IC314.10(S4)
N$600: IC307.3(1B) IC315.4(S1)
N$601: IC28.4(A3) IC286.13(S3)
N$602: IC77.15(Q6)
N$603: IC28.5(A4) IC286.10(S4)
N$604: IC28.6(A5) IC287.4(S1)
N$605: IC77.16(Q7)
N$606: IC77.19(Q8)
N$607: IC307.6(2B) IC315.1(S2)
N$608: IC307.10(3B) IC315.13(S3)
N$609: IC179.5(Y) IC180.6(1C0)
N$610: IC180.5(1C1) IC181.5(Y)
N$611: IC180.4(1C2) IC182.5(Y)
N$612: IC307.13(4B) IC315.10(S4)
N$613: IC180.10(2C0) IC184.5(Y)
N$614: IC180.11(2C1) IC185.5(Y)
N$615: IC180.12(2C2) IC189.5(Y)
N$616: IC308.3(1B) IC318.4(S1)
N$617: IC208.5(Y)
N$618: IC86.5(1C1) IC193.5(Y)
N$619: IC86.10(2C0) IC200.5(Y)
N$620: IC86.11(2C1) IC209.5(Y)
N$621: IC87.6(1C0) IC212.5(Y)
N$622: IC87.5(1C1) IC215.5(Y)
N$623: IC87.10(2C0) IC216.5(Y)
N$624: IC87.11(2C1) IC217.5(Y)
N$625: IC111.6(1C0) IC233.5(Y)
N$626: IC111.5(1C1) IC246.5(Y)
N$627: IC111.10(2C0) IC248.5(Y)
N$628: IC111.11(2C1) IC249.5(Y)
N$629: IC139.6(1C0) IC251.5(Y)
N$630: IC139.5(1C1) IC252.5(Y)
N$631: IC139.10(2C0) IC253.5(Y)
N$632: IC139.11(2C1) IC254.5(Y)
N$635: IC86.7(1Y) IC113.3(1B)
N$636: IC86.9(2Y) IC113.6(2B)
N$637: IC87.7(1Y) IC113.10(3B)
N$638: IC87.9(2Y) IC113.13(4B)
N$639: IC111.7(1Y) IC128.3(1B)
N$640: IC239.3(B:I) IC240.6(A:O)
N$641: IC47.4(B:O) IC141.5(B:I2)
N$642: IC273.1(1G) IC273.15(2G) IC274.1(1G) IC274.15(2G) IC275.1(1G) IC275.15(2G) IC276.1(1G) IC276.15(2G) IC279.1(1G) IC279.15(2G) IC280.1(1G) IC280.15(2G) IC281.1(1G) IC281.15(2G) IC282.1(1G) IC282.15(2G)
N$643: IC62.6(B1) IC265.7(1Y)
N$644: IC62.2(B2) IC265.9(2Y)
N$645: IC308.6(2B) IC318.1(S2)
N$646: IC62.11(B4) IC266.9(2Y)
N$647: IC26.6(B1) IC267.7(1Y)
N$648: IC308.10(3B) IC318.13(S3)
N$649: IC26.15(B3) IC268.7(1Y)
N$650: IC26.11(B4) IC268.9(2Y)
N$651: IC269.7(1Y) IC285.6(B1)
N$652: IC269.9(2Y) IC285.2(B2)
N$653: IC272.7(1Y) IC285.15(B3)
N$654: IC272.9(2Y) IC285.11(B4)
N$655: IC28.7(A6) IC287.1(S2)
N$656: IC28.8(A7) IC287.13(S3)
N$657: IC28.9(A8) IC287.10(S4)
N$661: INT_CODE_REG.5(2Q)
N$662: INT_CODE_REG.6(3Q)
N$665: IC92.4(B:O) IC222.4(G2A) IC222.5(G2B)
N$666: INT_CODE_REG.16(7Q)
N$667: INT_CODE_REG.19(8Q)
N$669: IC282.7(1Y) IC283.5(A1)
N$670: IC56.9(C4) IC283.7(C0)
N$671: IC283.9(C4) IC284.7(C0)
N$672: IC284.9(C4) IC286.7(C0)
N$673: IC286.9(C4) IC287.7(C0)
N$674: IC282.9(2Y) IC283.3(A2)
N$675: IC279.7(1Y) IC283.14(A3)
N$676: IC279.9(2Y) IC283.12(A4)
N$677: IC280.7(1Y) IC284.5(A1)
N$678: IC280.9(2Y) IC284.3(A2)
N$679: IC281.7(1Y) IC284.14(A3)
N$680: IC281.9(2Y) IC284.12(A4)
N$681: IC275.7(1Y) IC286.5(A1)
N$682: IC275.9(2Y) IC286.3(A2)
N$683: IC276.7(1Y) IC286.14(A3)
N$684: IC276.9(2Y) IC286.12(A4)
N$685: IC220.1(A:I0) IC222.12(Y3)
N$686: IC273.7(1Y) IC287.5(A1)
N$687: IC222.10(Y5) IC224.1(A:I0)
N$688: IC111.9(2Y) IC128.6(2B)
N$689: IC128.10(3B) IC139.7(1Y)
N$690: IC161.2(A:I1) IC163.5(A:Q)
N$691: IC164.5(A:Q) IC196.2(A:I1)
N$693: INT_STATUS_REG.4(D2)
N$694: INT_STATUS_REG.7(D3)
N$695: INT_STATUS_REG.8(D4)
N$696: INT_STATUS_REG.13(D5)
N$697: INT_STATUS_REG.14(D6)
N$698: INT_STATUS_REG.17(D7)
N$699: INT_STATUS_REG.18(D8)
N$700: IC128.13(4B) IC139.9(2Y)
N$701: IC308.13(4B) IC318.10(S4)
N$702: IC309.3(1B) IC319.4(S1)
N$703: IC309.6(2B) IC319.1(S2)
N$704: IC309.10(3B) IC319.13(S3)
N$705: IC229.1(A:I0) IC232.6(B:O)
N$706: IC141.8(C:O) IC232.5(B:I1)
N$707: IC43.10(E:O) IC141.11(C:I2) IC144.4(A:I2)
N$708: IC43.12(F:O) IC45.1(A:I0) IC141.10(C:I1)
N$709: IC309.13(4B) IC319.10(S4)
N$710: IC45.3(A:O) IC238.5(B:I1)
N$711: IC144.5(A:I3) IC238.6(B:O)
N$722: IC273.9(2Y) IC287.3(A2)
N$723: IC274.7(1Y) IC287.14(A3)
N$724: IC274.9(2Y) IC287.12(A4)
N$761: IC285.4(S1) IC302.2(A1)
N$762: IC285.1(S2) IC302.3(A2)
N$763: IC285.13(S3) IC302.4(A3)
N$764: IC285.10(S4) IC302.5(A4)
N$1062: IC411.3(A:S2) R23.1 S3.1(O)
N$1063: IC411.1(A:R) R24.1 S3.3(S)
N$1067: IC410.3(B:I) IC412.3(Q1)
N$1068: IC126.3(B:I) IC412.7(CLK) SW1.C
N$1069: IC412.1(M) IC412.2(N) IC415.6(B:O)
NORMAL_CLK: SW1.2
NOT_RST: IC137.1(CLR)
OF: FLAGS.9(Q4) IC23.4(D0) IC156.10(2C0)
OF_FROM_ALU: IC23.3(D1) IC127.3(1B) IC133.3(A:O) IC156.12(2C2)
OF_IN_SRC_0: IC23.11(A)
OF_IN_SRC_1: IC23.10(B)
OF_IN_SRC_2: IC23.9(C)
PANEL_MEM_IO: RN4.3
PANEL_RD: RN4.1
PANEL_WR: RN4.2
PC_0: IC265.6(1C0)
PC_1: IC265.10(2C0)
PC_H_0: IC2.3(D1) IC29.3(D1) IC81.3(D1) IC100.3(D1) IC114.3(D1) IC145.3(D1) IC179.3(D1) IC294.6(1C0)
PC_H_1: IC184.3(D1) IC294.10(2C0)
PC_H_2: IC295.6(1C0)
PC_H_3: IC295.10(2C0)
PC_H_4: IC296.6(1C0)
PC_H_5: IC296.10(2C0)
PC_H_6: IC297.6(1C0)
PC_H_7: IC297.10(2C0)
PC_H_WRT: IC101.1(G)
PC_L_0: IC2.4(D0) IC29.4(D0) IC81.4(D0) IC100.4(D0) IC114.4(D0) IC145.4(D0) IC179.4(D0) IC299.6(1C0)
PC_L_1: IC184.4(D0) IC299.10(2C0)
PC_L_2: IC298.6(1C0)
PC_L_3: IC298.10(2C0)
PC_L_4: IC292.6(1C0)
PC_L_5: IC292.10(2C0)
PC_L_6: IC293.6(1C0)
PC_L_7: IC293.10(2C0)
PC_L_WRT: IC102.1(G)
PMSC_SRC: IC1.1(!A!/B) IC230.1(!A!/B) IC256.1(!A!/B) IC259.1(!A!/B)
PMSC_SRC_0: IC299.14(A)
PMSC_SRC_1: IC299.2(B)
PROG_MODE: IC250.5(B:I1)
RD: IC60.2(Q1) IC69.11(B:A1)
RST: AUX_FLAGS_H1.15(CLR) AUX_FLAGS_L1.15(CLR) IC9.15(CLR) IC27.15(CLR) IC147.2(A:I0) IC412.15(CLR) IC414.3(B:I) R25.1 S5.2(P)
SF: FLAGS.6(Q3) IC156.6(1C0) IC255.6(1C0)
SF_FROM_ALU: IC25.2(A:I1) IC121.3(1B) IC156.4(1C2)
SF_IN_SRC_0: IC255.14(A)
SF_IN_SRC_1: IC255.2(B)
SF_XOR_OF1: IC59.6(B:O) IC153.4(B:I0) IC178.13(D6)
SHR_MSB_SRC_0: IC16.11(A)
SHR_MSB_SRC_1: IC16.10(B)
SHR_MSB_SRC_2: IC16.9(C)
SI_0: IC265.4(1C2)
SI_1: IC265.12(2C2)
SI_H_0: IC5.14(D5) IC30.14(D5) IC84.14(D5) IC107.14(D5) IC119.14(D5) IC146.14(D5) IC181.14(D5)
SI_H_1: IC185.14(D5)
SI_L_0: IC5.15(D4) IC30.15(D4) IC84.15(D4) IC106.2(1Q) IC107.15(D4) IC119.15(D4) IC146.15(D4) IC181.15(D4) IC310.5(A1)
SI_L_1: IC185.15(D4)
SIDI_IN_SRC: IC300.1(!A!/B)
SINGLE_STEP_CLK: IC411.4(A:Q) SW1.1
SP_H_0: IC2.14(D5) IC29.14(D5) IC81.14(D5) IC100.14(D5) IC114.14(D5) IC145.14(D5) IC179.14(D5)
SP_H_1: IC184.14(D5)
SP_L_0: IC2.15(D4) IC29.15(D4) IC81.15(D4) IC100.15(D4) IC114.15(D4) IC145.15(D4) IC179.15(D4) IC299.4(1C2)
SP_L_1: IC184.15(D4)
SPH_WRT: IC245.1(G)
SPL_WRT: IC260.1(G)
SS_H_0: IC5.1(D3) IC30.1(D3) IC84.1(D3) IC107.1(D3) IC119.1(D3) IC146.1(D3) IC181.1(D3) IC275.4(1C2)
SS_H_1: IC185.1(D3) IC275.12(2C2)
SS_H_2: IC276.4(1C2)
SS_H_3: IC276.12(2C2)
SS_H_4: IC273.4(1C2)
SS_H_5: IC273.12(2C2)
SS_H_6: IC274.4(1C2)
SS_H_7: IC274.12(2C2)
SS_H_WRT: IC320.1(G)
SS_L_0: IC5.2(D2) IC30.2(D2) IC84.2(D2) IC107.2(D2) IC119.2(D2) IC146.2(D2) IC181.2(D2) IC282.4(1C2)
SS_L_1: IC185.2(D2) IC282.12(2C2)
SS_L_2: IC279.4(1C2)
SS_L_3: IC279.12(2C2)
SS_L_4: IC280.4(1C2)
SS_L_5: IC280.12(2C2)
SS_L_6: IC281.4(1C2)
SS_L_7: IC281.12(2C2)
STOP_CLK: IC413.2(A:D) IC413.5(A:Q) IC415.4(B:I0) R26.1 S6.2(P)
TDR_H_0: IC98.2(D2) IC193.3(D1)
TDR_H_WRT: IC54.1(G)
TDR_L_0: IC98.3(D1) IC193.4(D0)
TDR_L_WRT: IC544.1(G)
TRAP_ACK: IC147.3(A:I1)
TRAP_PENDING: IC43.11(E:I) IC141.6(B:O) IC232.4(B:I0) IC235.11(C:I2)
TRAP_REQ: IC39.3(A:CLK) IC141.3(B:I0) R1.2 R2.1
TRISTATE: IC28.1(G1) IC28.19(G2) IC69.19(B:G) IC250.6(B:O) IC302.1(G1) IC302.19(G2) IC303.1(G1) IC303.19(G2)
TYP0: IC43.9(D:I) IC214.5(B:I1)
TYP1: IC144.1(A:I0) IC213.2(A:I1) IC235.9(C:I0)
TYP_0: IC42.9(C:I0)
TYP_1: IC43.1(A:I)
U_AD0: IC32.2(Q1) U$6.10(A0) U$7.10(A0) U$8.10(A0) U$9.10(A0)
U_AD1: IC32.5(Q2) U$6.9(A1) U$7.9(A1) U$8.9(A1) U$9.9(A1)
U_AD2: IC32.6(Q3) U$6.8(A2) U$7.8(A2) U$8.8(A2) U$9.8(A2)
U_AD3: IC32.9(Q4) U$6.7(A3) U$7.7(A3) U$8.7(A3) U$9.7(A3)
U_AD4: IC32.12(Q5) U$6.6(A4) U$7.6(A4) U$8.6(A4) U$9.6(A4)
U_AD5: IC32.15(Q6) U$6.5(A5) U$7.5(A5) U$8.5(A5) U$9.5(A5)
U_AD6: IC32.16(Q7) U$6.4(A6) U$7.4(A6) U$8.4(A6) U$9.4(A6)
U_AD7: IC32.19(Q8) U$6.3(A7) U$7.3(A7) U$8.3(A7) U$9.3(A7)
U_AD8: IC33.2(Q1) U$6.25(A8) U$7.25(A8) U$8.25(A8) U$9.25(A8)
U_AD9: IC33.5(Q2) U$6.24(A9) U$7.24(A9) U$8.24(A9) U$9.24(A9)
U_AD10: IC33.6(Q3) U$6.21(A10) U$7.21(A10) U$8.21(A10) U$9.21(A10)
U_AD11: IC33.9(Q4) U$6.23(A11) U$7.23(A11) U$8.23(A11) U$9.23(A11)
U_AD12: IC33.12(Q5) U$6.2(A12) U$7.2(A12) U$8.2(A12) U$9.2(A12)
U_AD13: IC33.15(Q6) U$6.26(A13) U$7.26(A13) U$8.26(A13) U$9.26(A13)
U_AD14: IC33.16(Q7) IC53.14(A3)
U_AD15: IC33.19(Q8) IC53.12(A4)
U_AD16: U$13.10(A0) U$14.10(A0) U$15.10(A0) U$16.10(A0)
U_AD17: U$13.9(A1) U$14.9(A1) U$15.9(A1) U$16.9(A1)
U_AD18: U$13.8(A2) U$14.8(A2) U$15.8(A2) U$16.8(A2)
U_AD19: U$13.7(A3) U$14.7(A3) U$15.7(A3) U$16.7(A3)
U_AD20: U$13.6(A4) U$14.6(A4) U$15.6(A4) U$16.6(A4)
U_AD21: U$13.5(A5) U$14.5(A5) U$15.5(A5) U$16.5(A5)
U_AD22: U$13.4(A6) U$14.4(A6) U$15.4(A6) U$16.4(A6)
U_AD23: U$13.3(A7) U$14.3(A7) U$15.3(A7) U$16.3(A7)
U_AD24: U$13.25(A8) U$14.25(A8) U$15.25(A8) U$16.25(A8)
U_AD25: U$13.24(A9) U$14.24(A9) U$15.24(A9) U$16.24(A9)
U_AD26: U$13.21(A10) U$14.21(A10) U$15.21(A10) U$16.21(A10)
U_AD27: U$13.23(A11) U$14.23(A11) U$15.23(A11) U$16.23(A11)
U_AD28: U$13.2(A12) U$14.2(A12) U$15.2(A12) U$16.2(A12)
U_AD29: U$13.26(A13) U$14.26(A13) U$15.26(A13) U$16.26(A13)
U_AD_BUFF0: U$1.10(A0)
U_AD_BUFF1: U$1.9(A1)
U_AD_BUFF2: U$1.8(A2)
U_AD_BUFF3: U$1.7(A3)
U_AD_BUFF4: U$1.6(A4)
U_AD_BUFF5: U$1.5(A5)
U_AD_BUFF6: U$1.4(A6)
U_AD_BUFF7: U$1.3(A7)
U_AD_BUFF8: U$1.25(A8)
U_AD_BUFF9: U$1.24(A9)
U_AD_BUFF10: U$1.21(A10)
U_AD_BUFF11: U$1.23(A11)
U_AD_BUFF12: U$1.2(A12)
U_AD_BUFF13: U$1.26(A13)
U_ADDER_0: IC50.4(S1) IC186.4(D0)
U_ADDER_1: IC160.4(D0)
U_ADDER_2: IC159.4(D0)
U_ADDER_3: IC142.4(D0)
U_ADDER_4: IC129.4(D0)
U_ADDER_5: IC73.4(D0)
U_ADDER_6: IC34.4(D0)
U_ADDER_7: IC35.4(D0)
U_ADDER_8: IC36.4(D0)
U_ADDER_9: IC37.4(D0)
U_ADDER_10: IC38.4(D0)
U_ADDER_11: IC40.4(D0)
U_ADDER_12: IC41.4(D0)
U_ADDER_13: IC53.1(S2) IC71.4(D0)
U_ADDER_14: IC20.4(D0)
U_ADDER_15: IC172.4(D0)
U_CF: IC13.15(D4) IC16.3(D1) IC21.1(A:I) IC155.11(2C1) IC231.5(Q2) IC270.6(1C0)
U_CF_IN_SRC_0: IC270.14(A)
U_CF_IN_SRC_1: IC270.2(B)
U_DMA_0: IC186.15(D4) U_DMA_SW_L.8
U_DMA_1: IC160.15(D4) U_DMA_SW_L.7
U_DMA_2: IC159.15(D4) U_DMA_SW_L.6
U_DMA_3: IC142.15(D4) U_DMA_SW_L.5
U_DMA_4: IC129.15(D4) U_DMA_SW_L.4
U_DMA_5: IC73.15(D4) U_DMA_SW_L.3
U_DMA_6: IC34.15(D4) U_DMA_SW_L.2
U_DMA_7: IC35.15(D4) U_DMA_SW_L.1
U_DMA_8: IC36.15(D4) U_DMA_SW_H.8
U_DMA_9: IC37.15(D4) U_DMA_SW_H.7
U_DMA_10: IC38.15(D4) U_DMA_SW_H.6
U_DMA_11: IC40.15(D4) U_DMA_SW_H.5
U_DMA_12: IC41.15(D4) U_DMA_SW_H.4
U_DMA_13: IC71.15(D4) U_DMA_SW_H.3
U_DMA_14: IC20.15(D4) U_DMA_SW_H.2
U_DMA_15: IC172.15(D4) U_DMA_SW_H.1